# EasyEDA schematic SCH_Solenoid Door Lock using EM-18_2023-11-30.json

## Sheets
1 3x3 KeyPad: TITLE: Sheet_1; REV: 1.0; Date: 2023-11-17; Sheet: 1/1; Company: Your Company
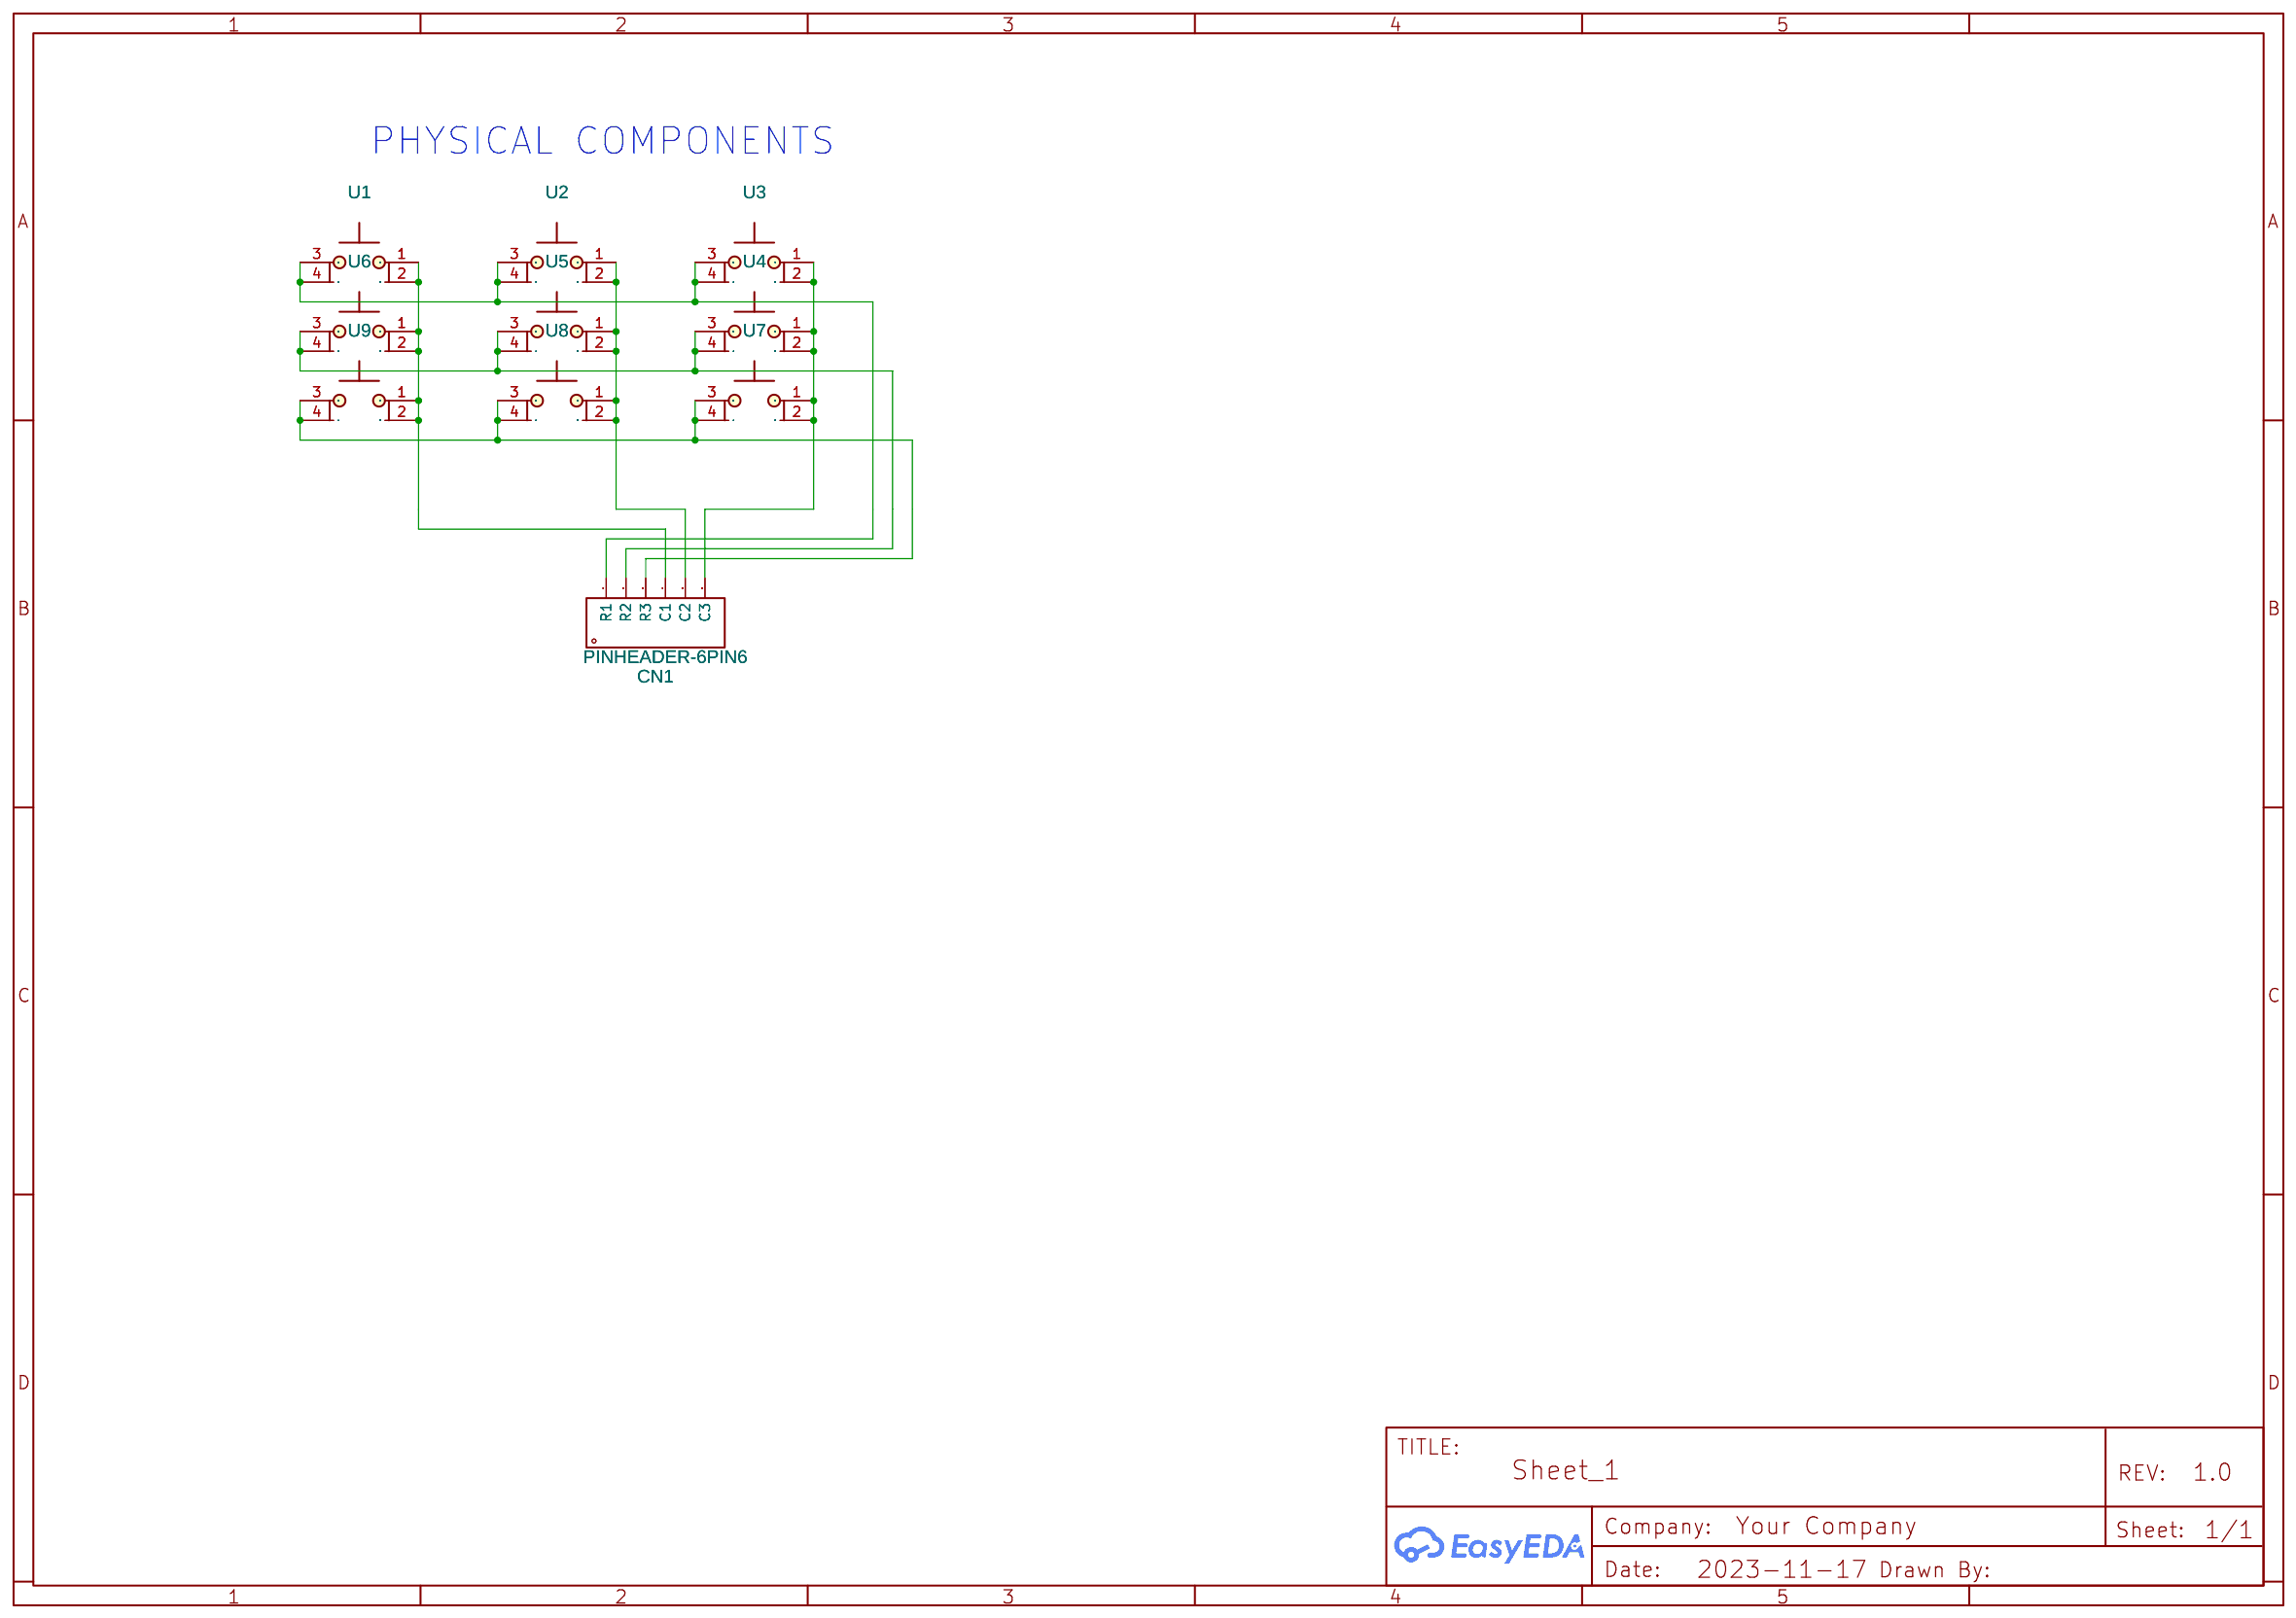
[diagram p0: 3x3 KeyPad]
2 EM-18 Module
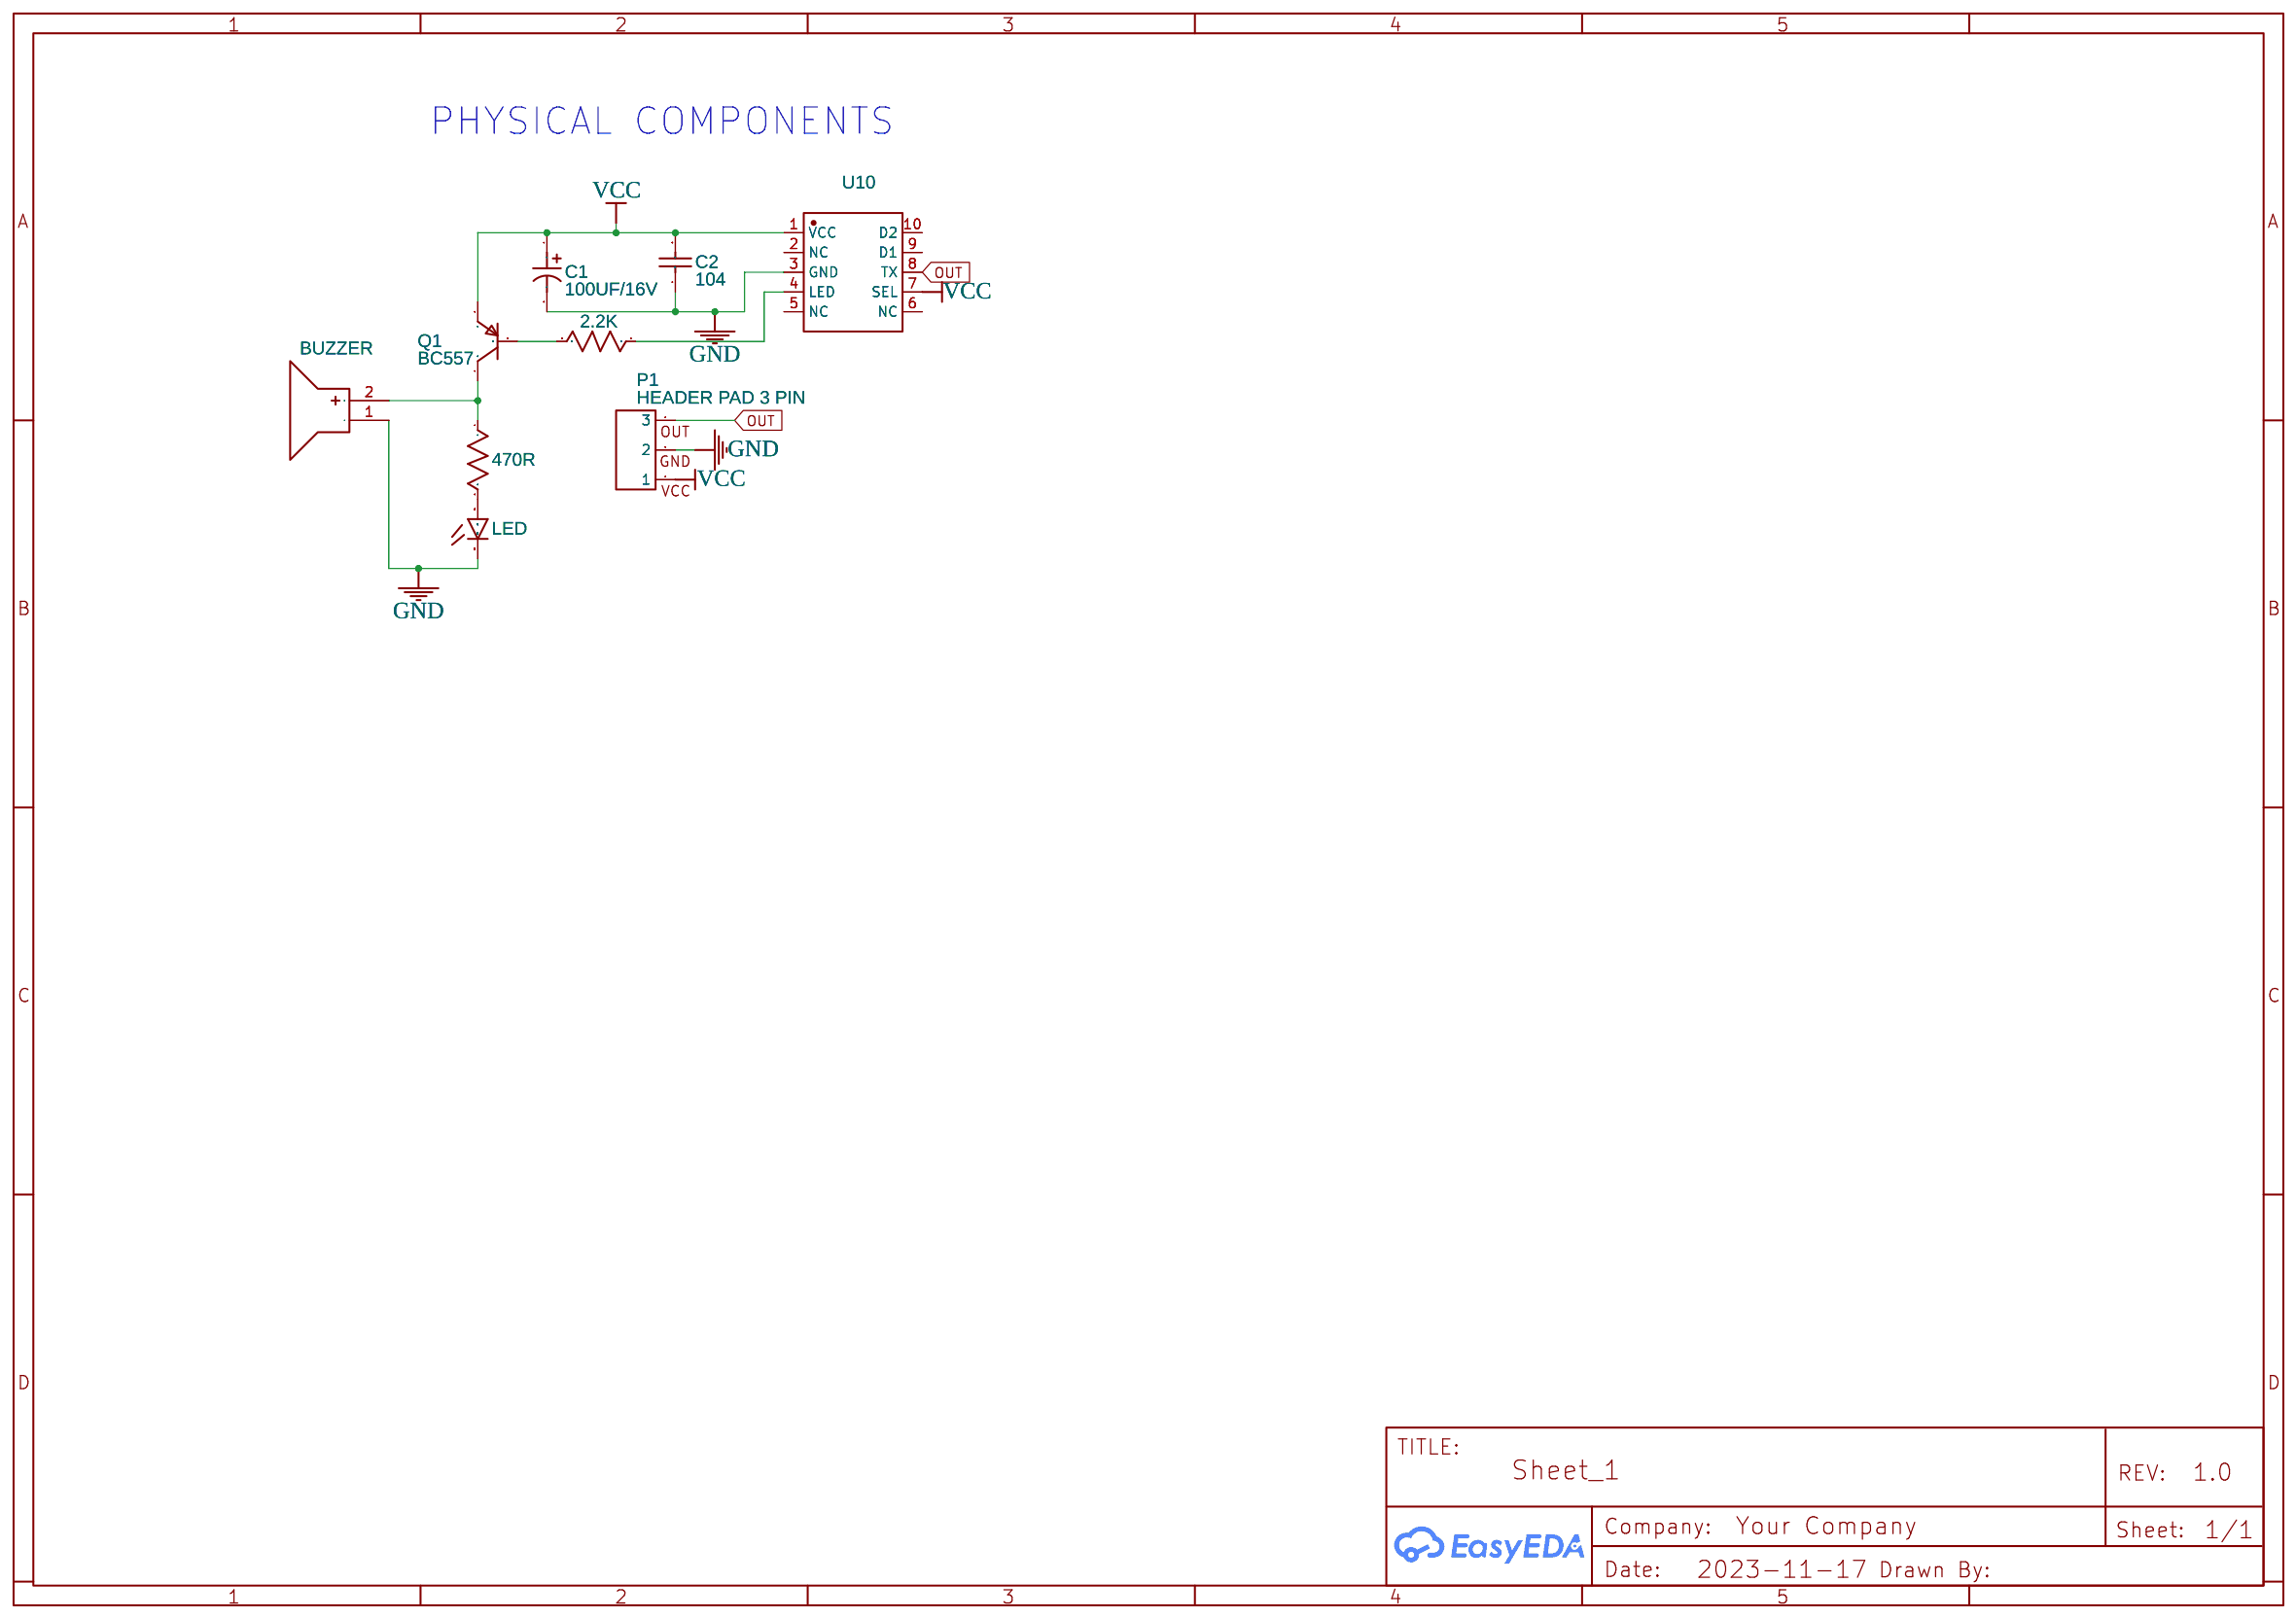
[diagram p1: EM-18 Module]
3 Relay Module
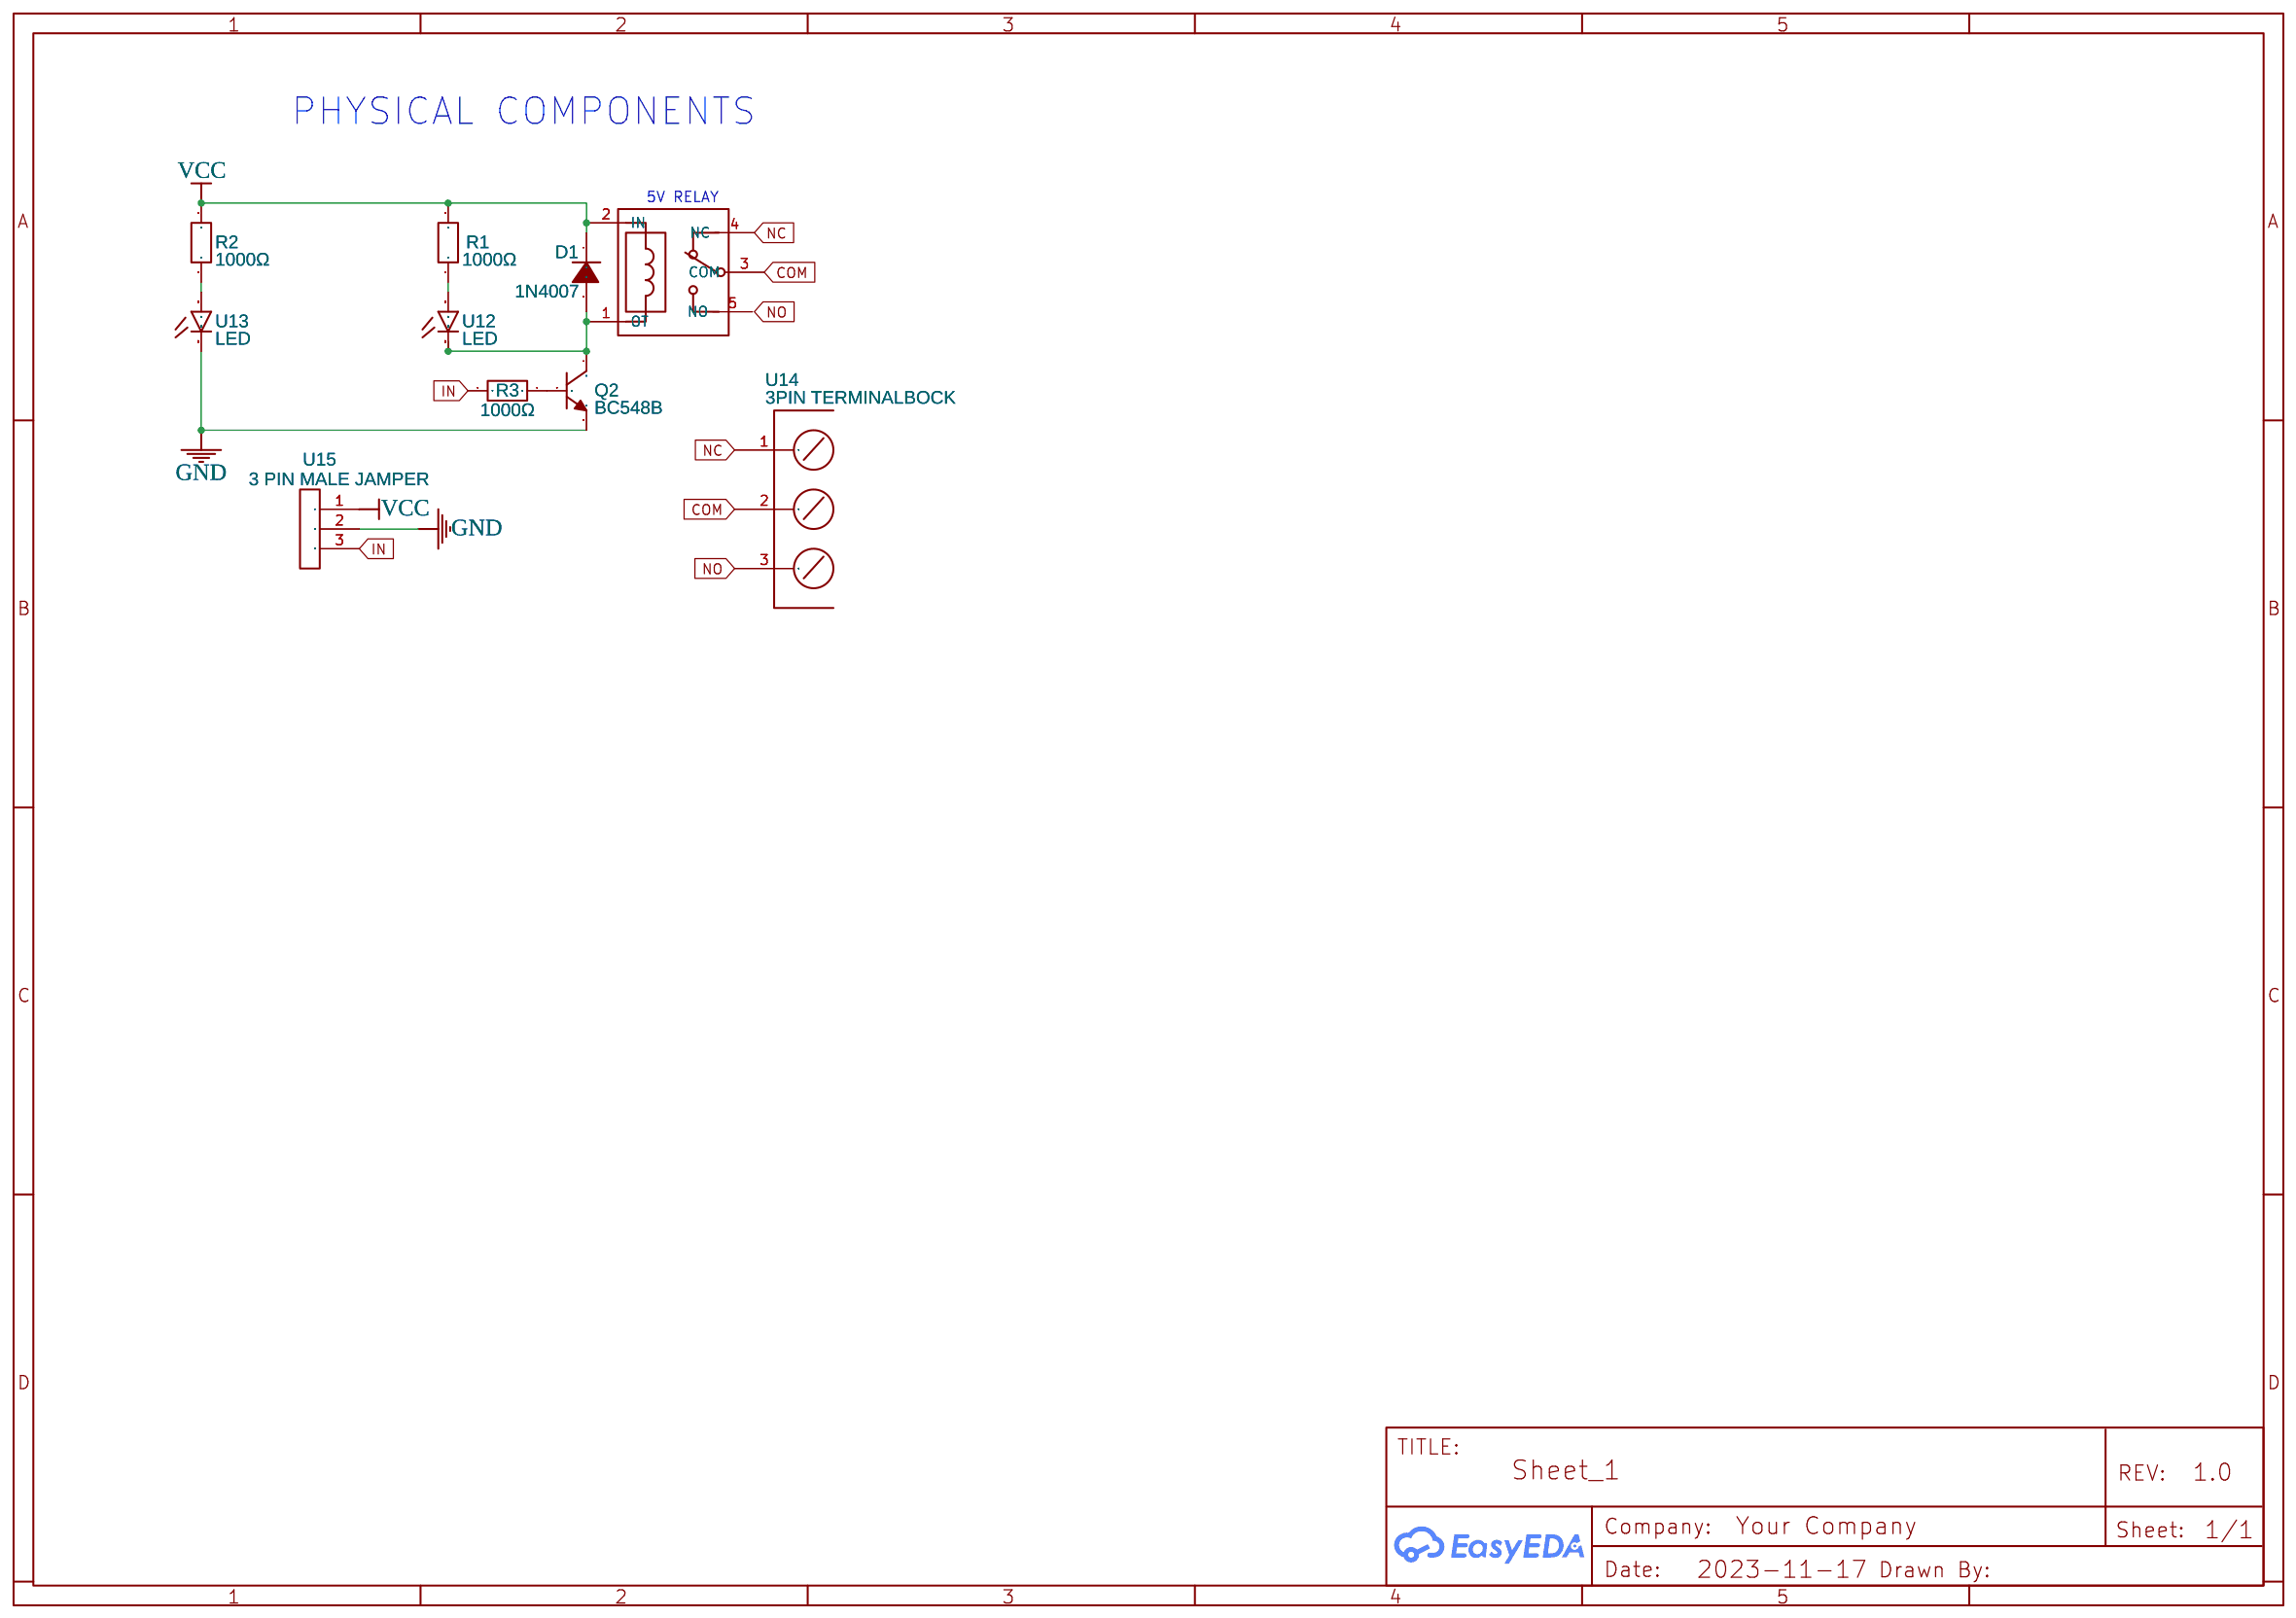
[diagram p2: Relay Module]
4 LCD Display: Date: 2023-11-18
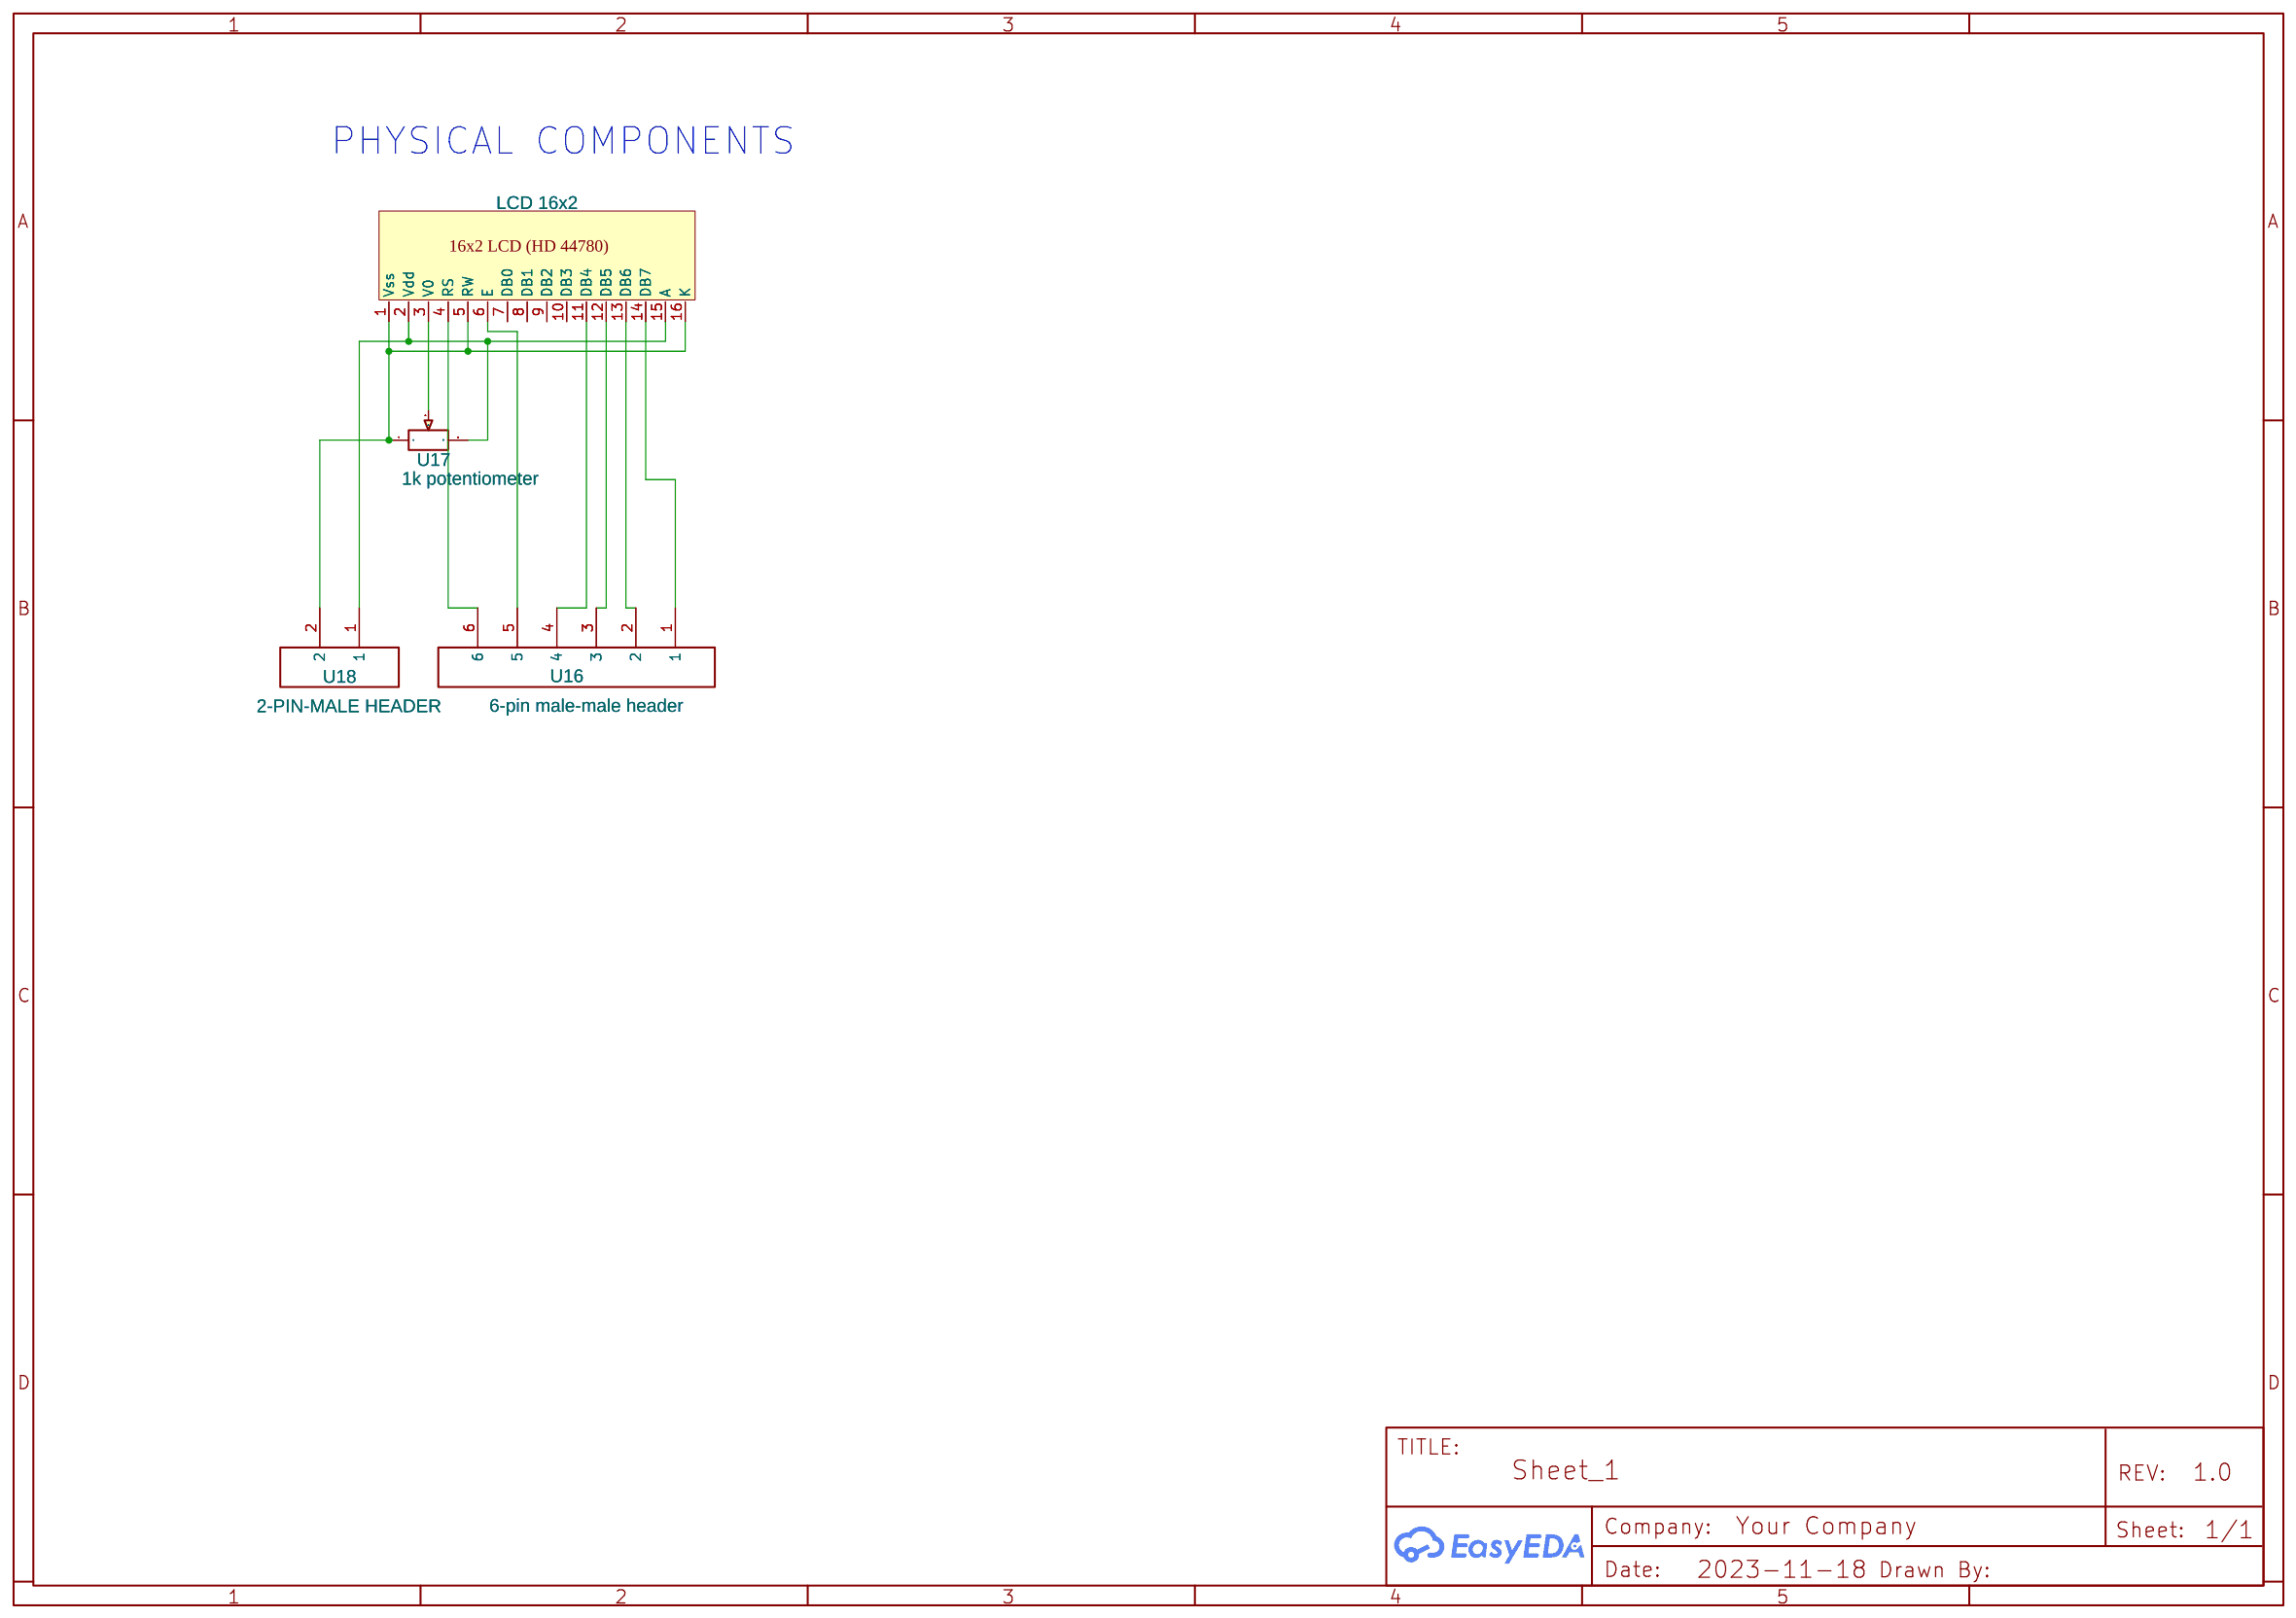
[diagram p3: LCD Display]
5 Final Display: Date: 2023-11-18
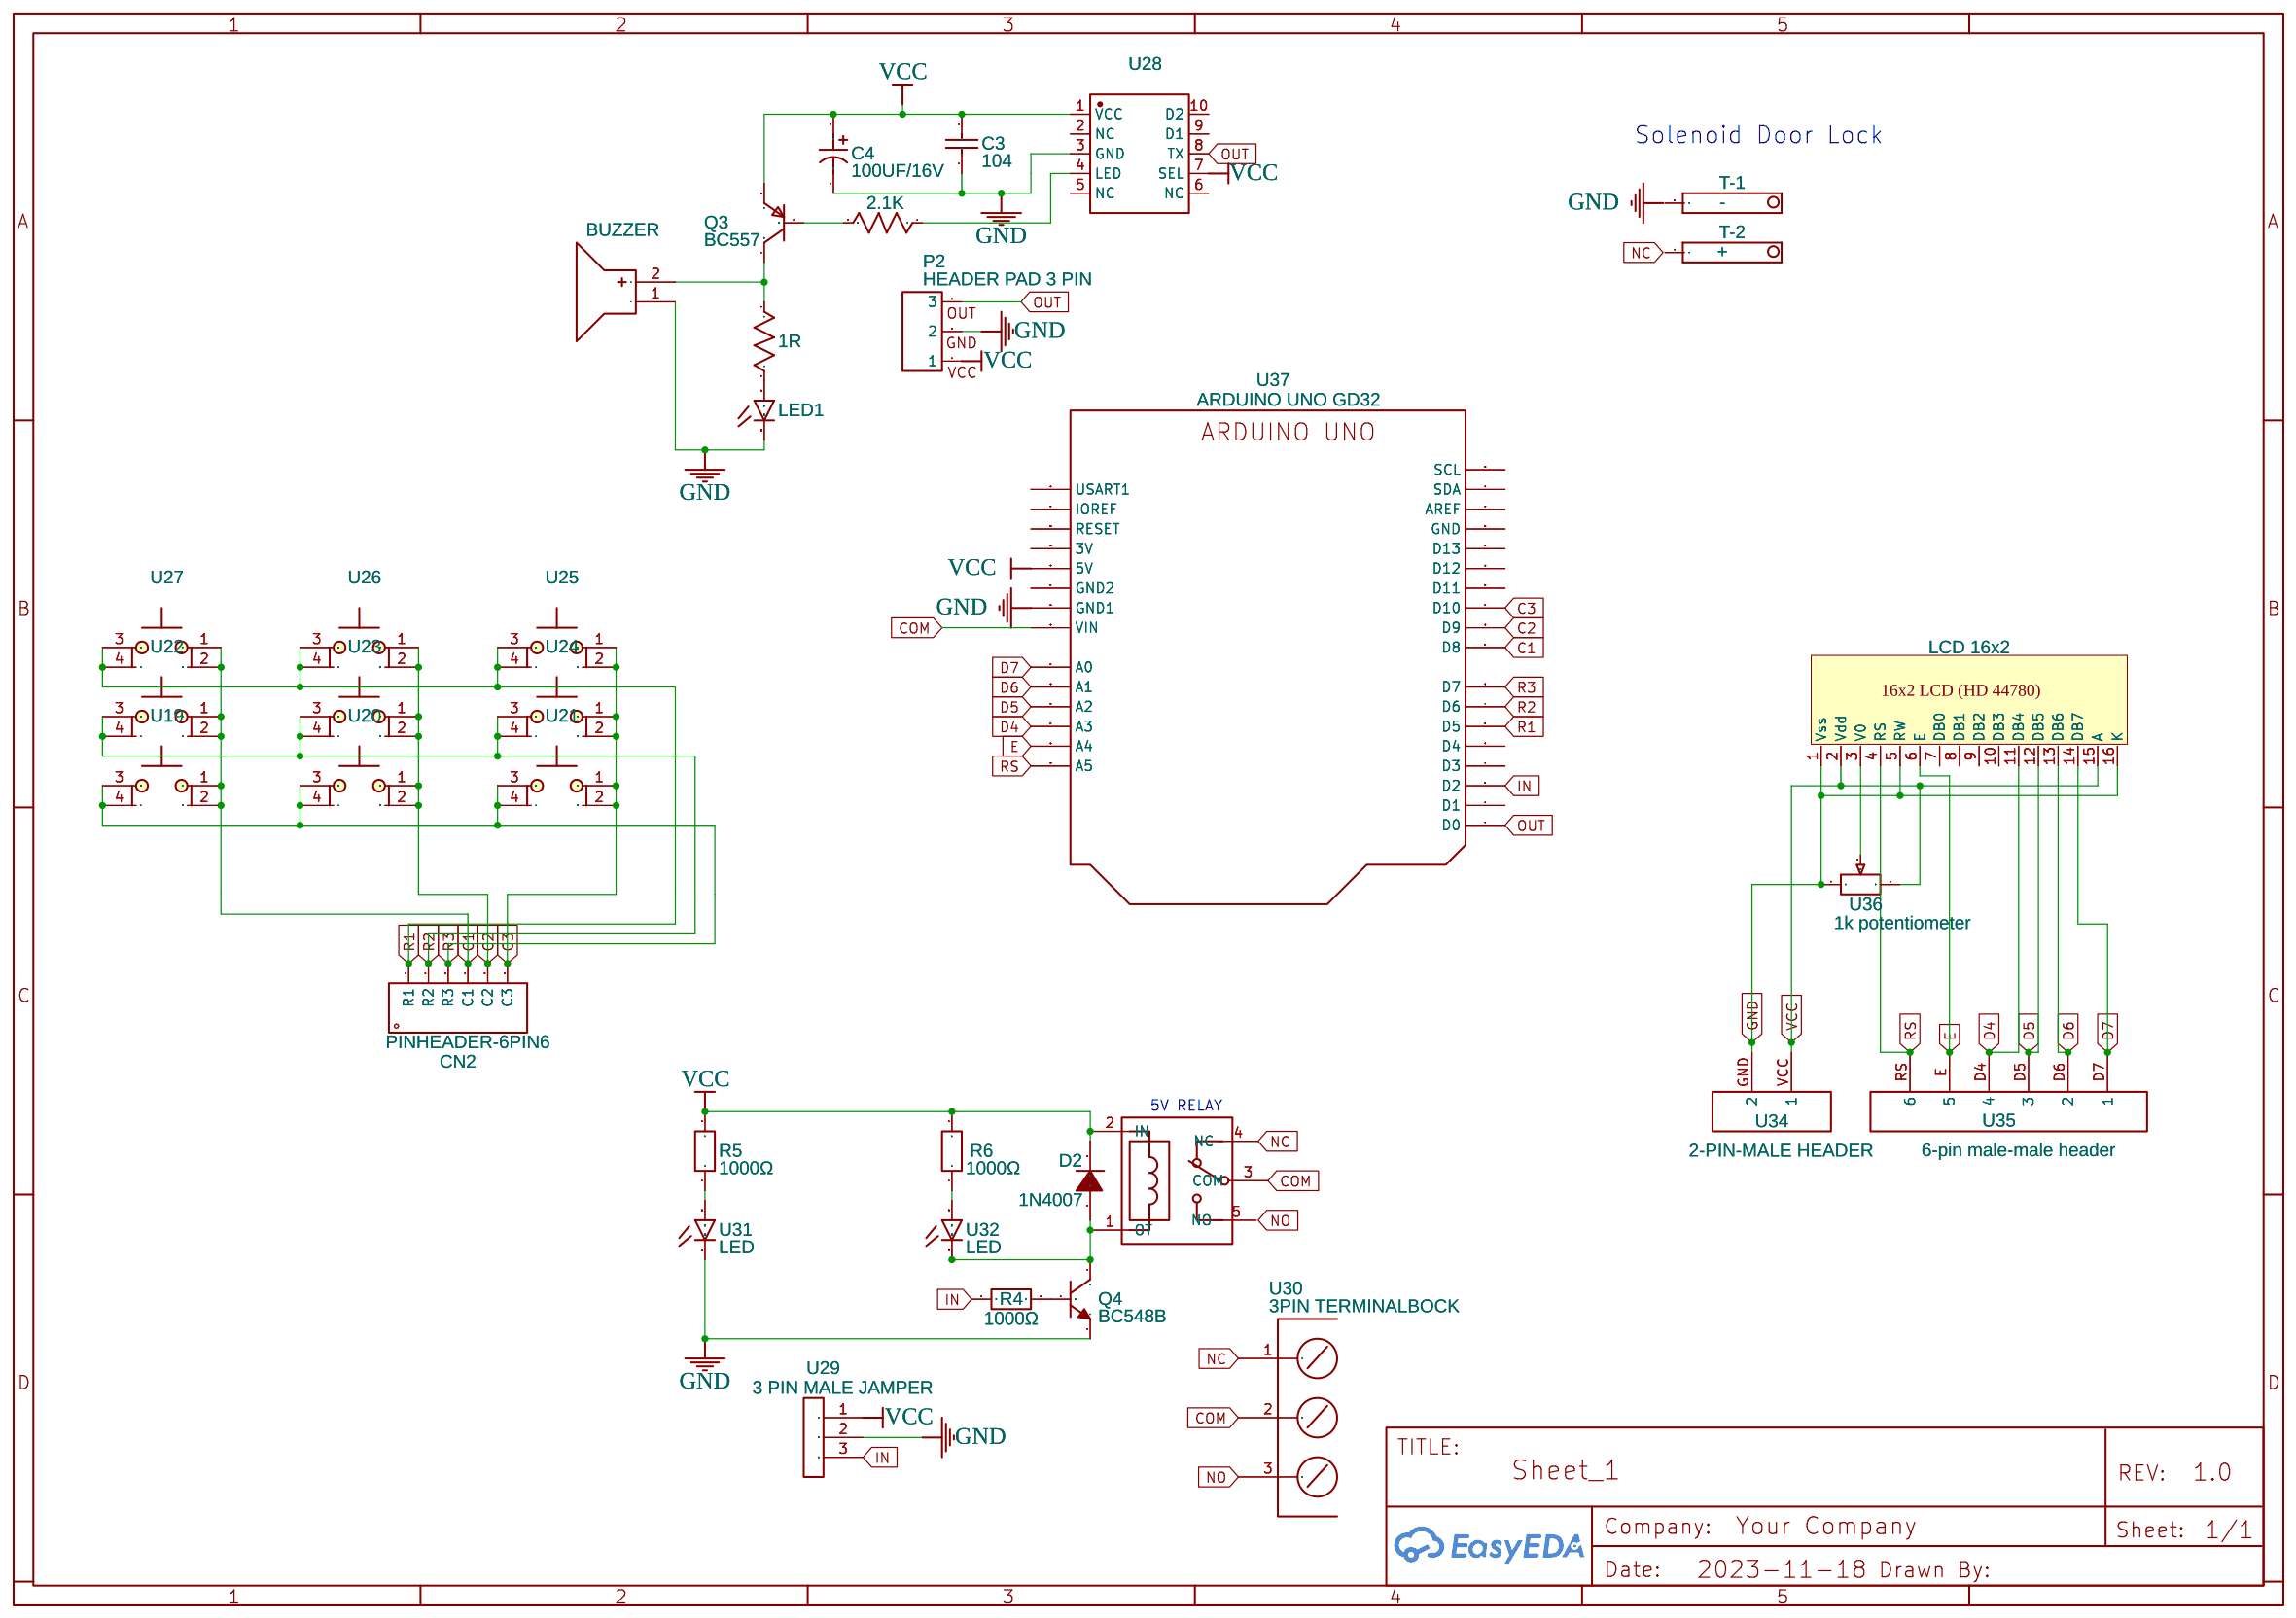
[diagram p4: Final Display]
6 Arduino_Keypad: Date: 2023-11-30
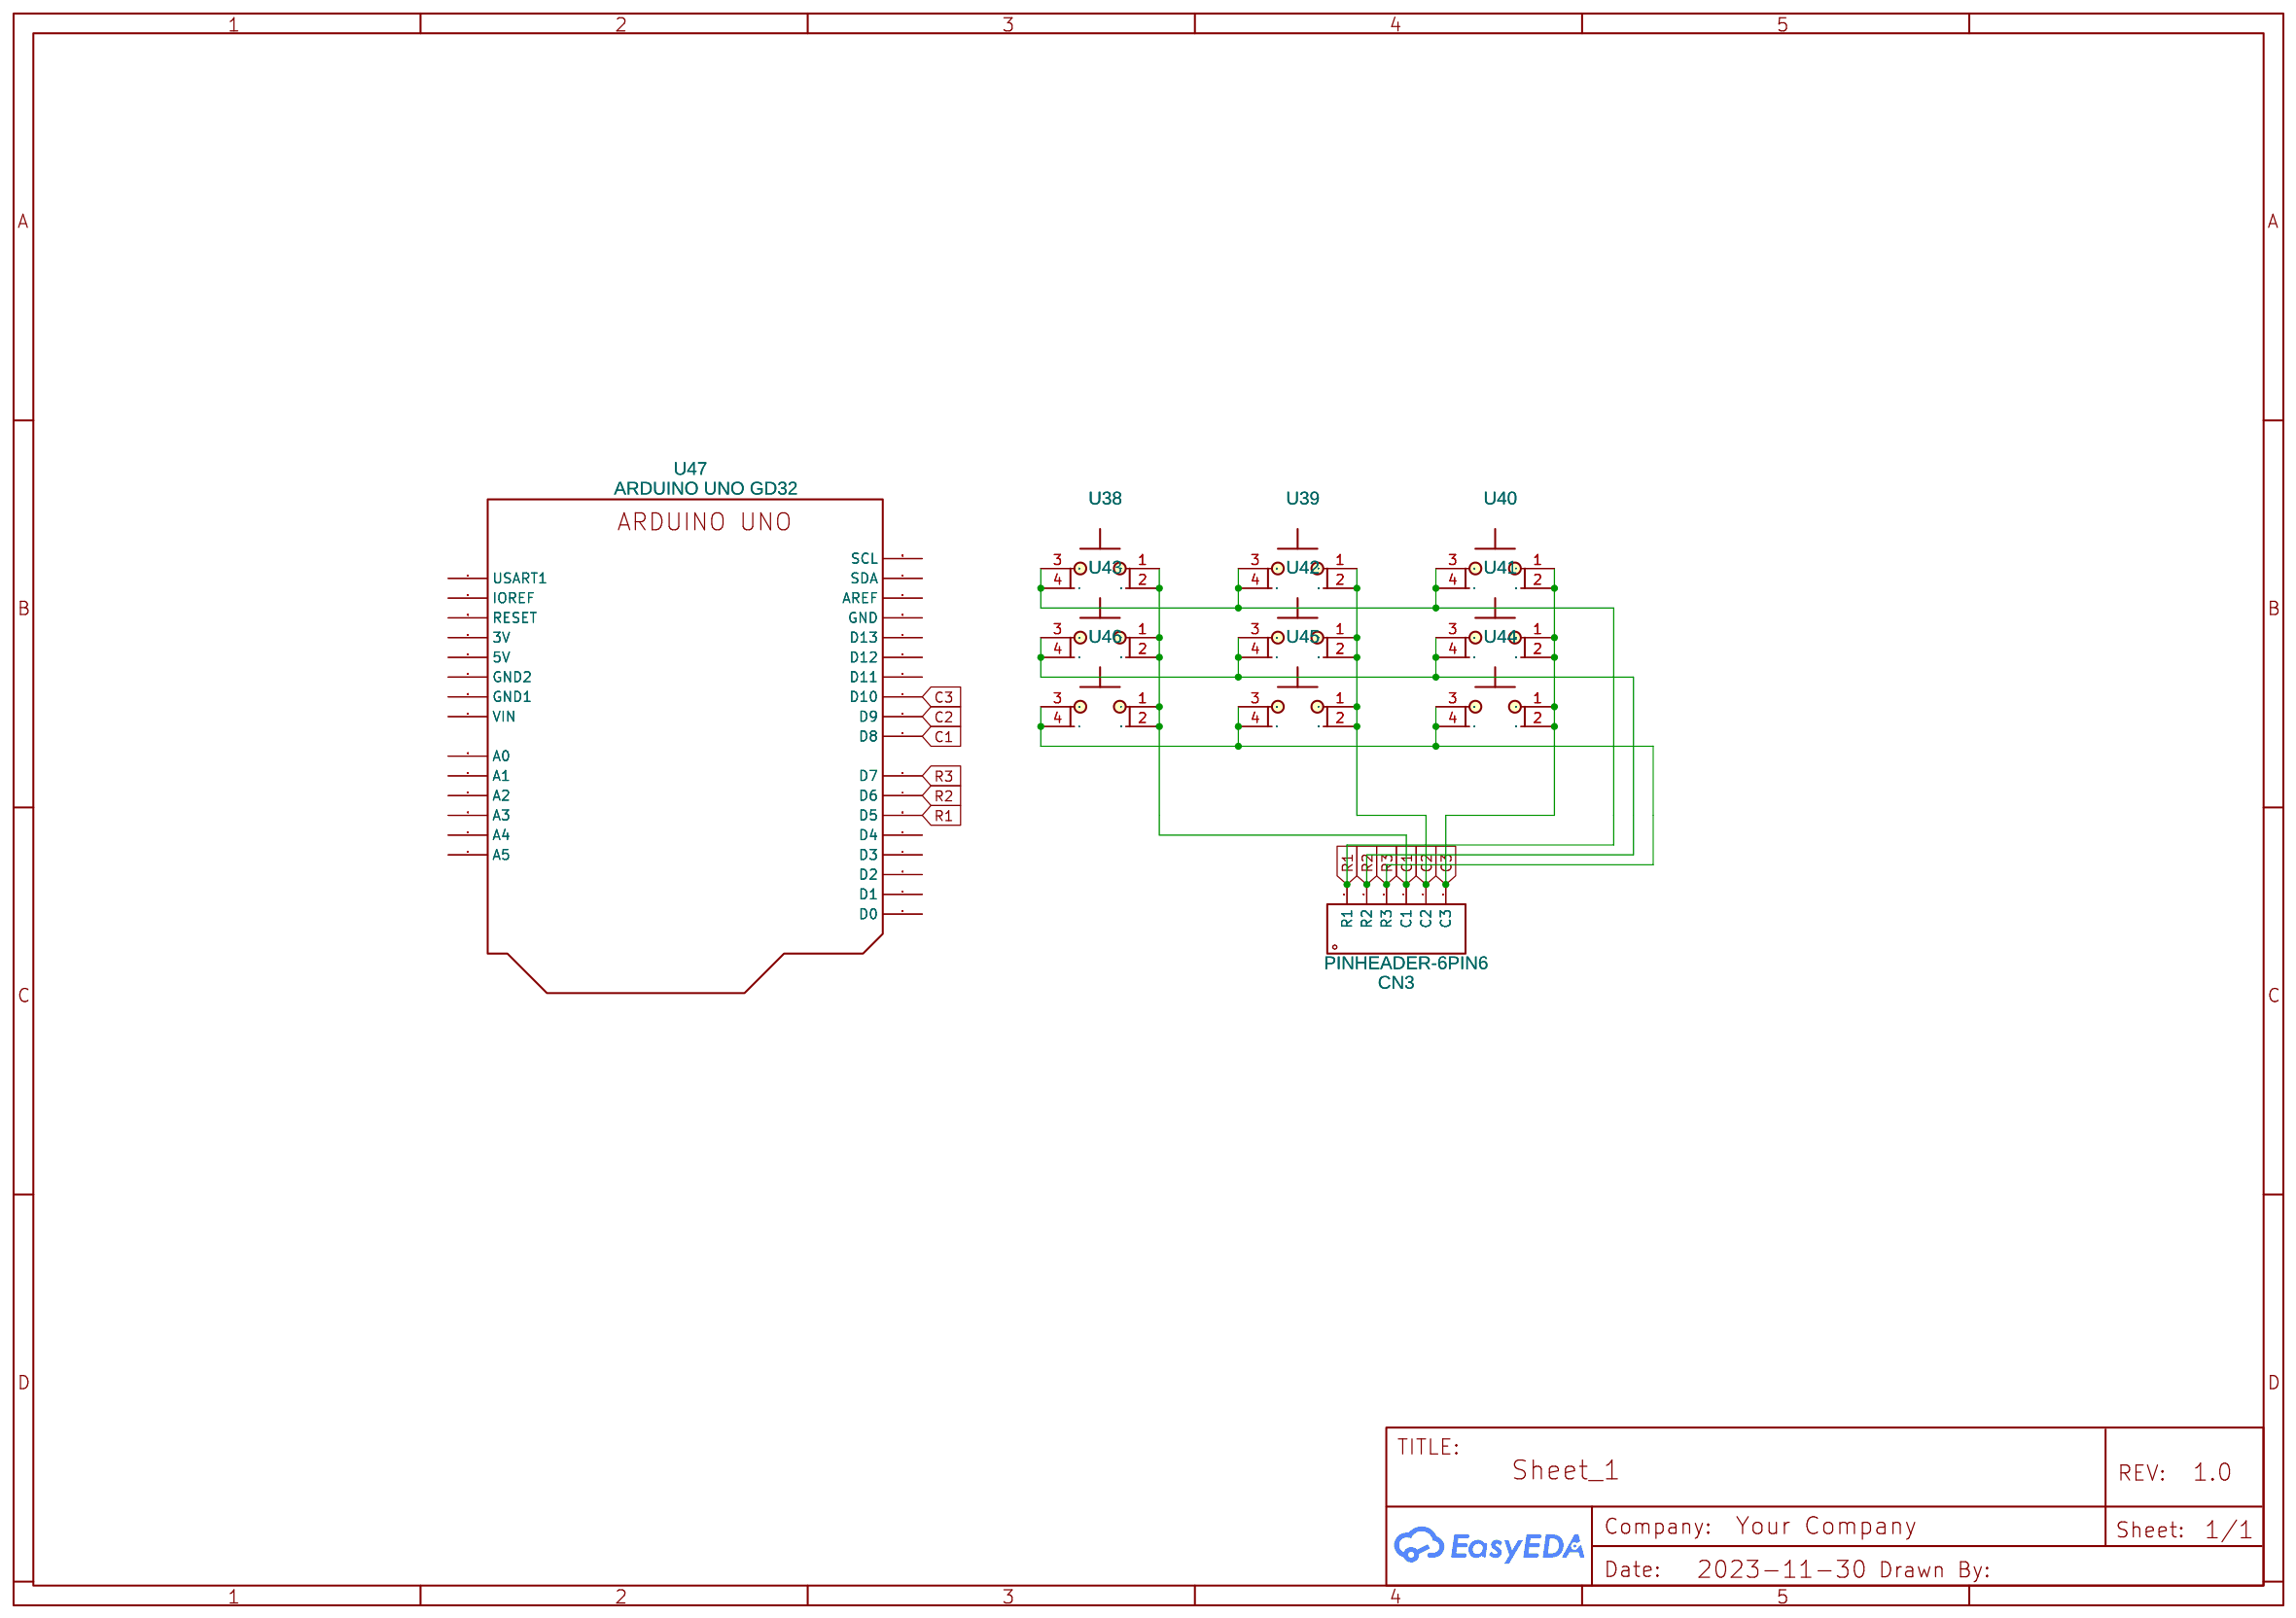
[diagram p5: Arduino_Keypad]
7 Arduino_LCD: Date: 2023-11-30
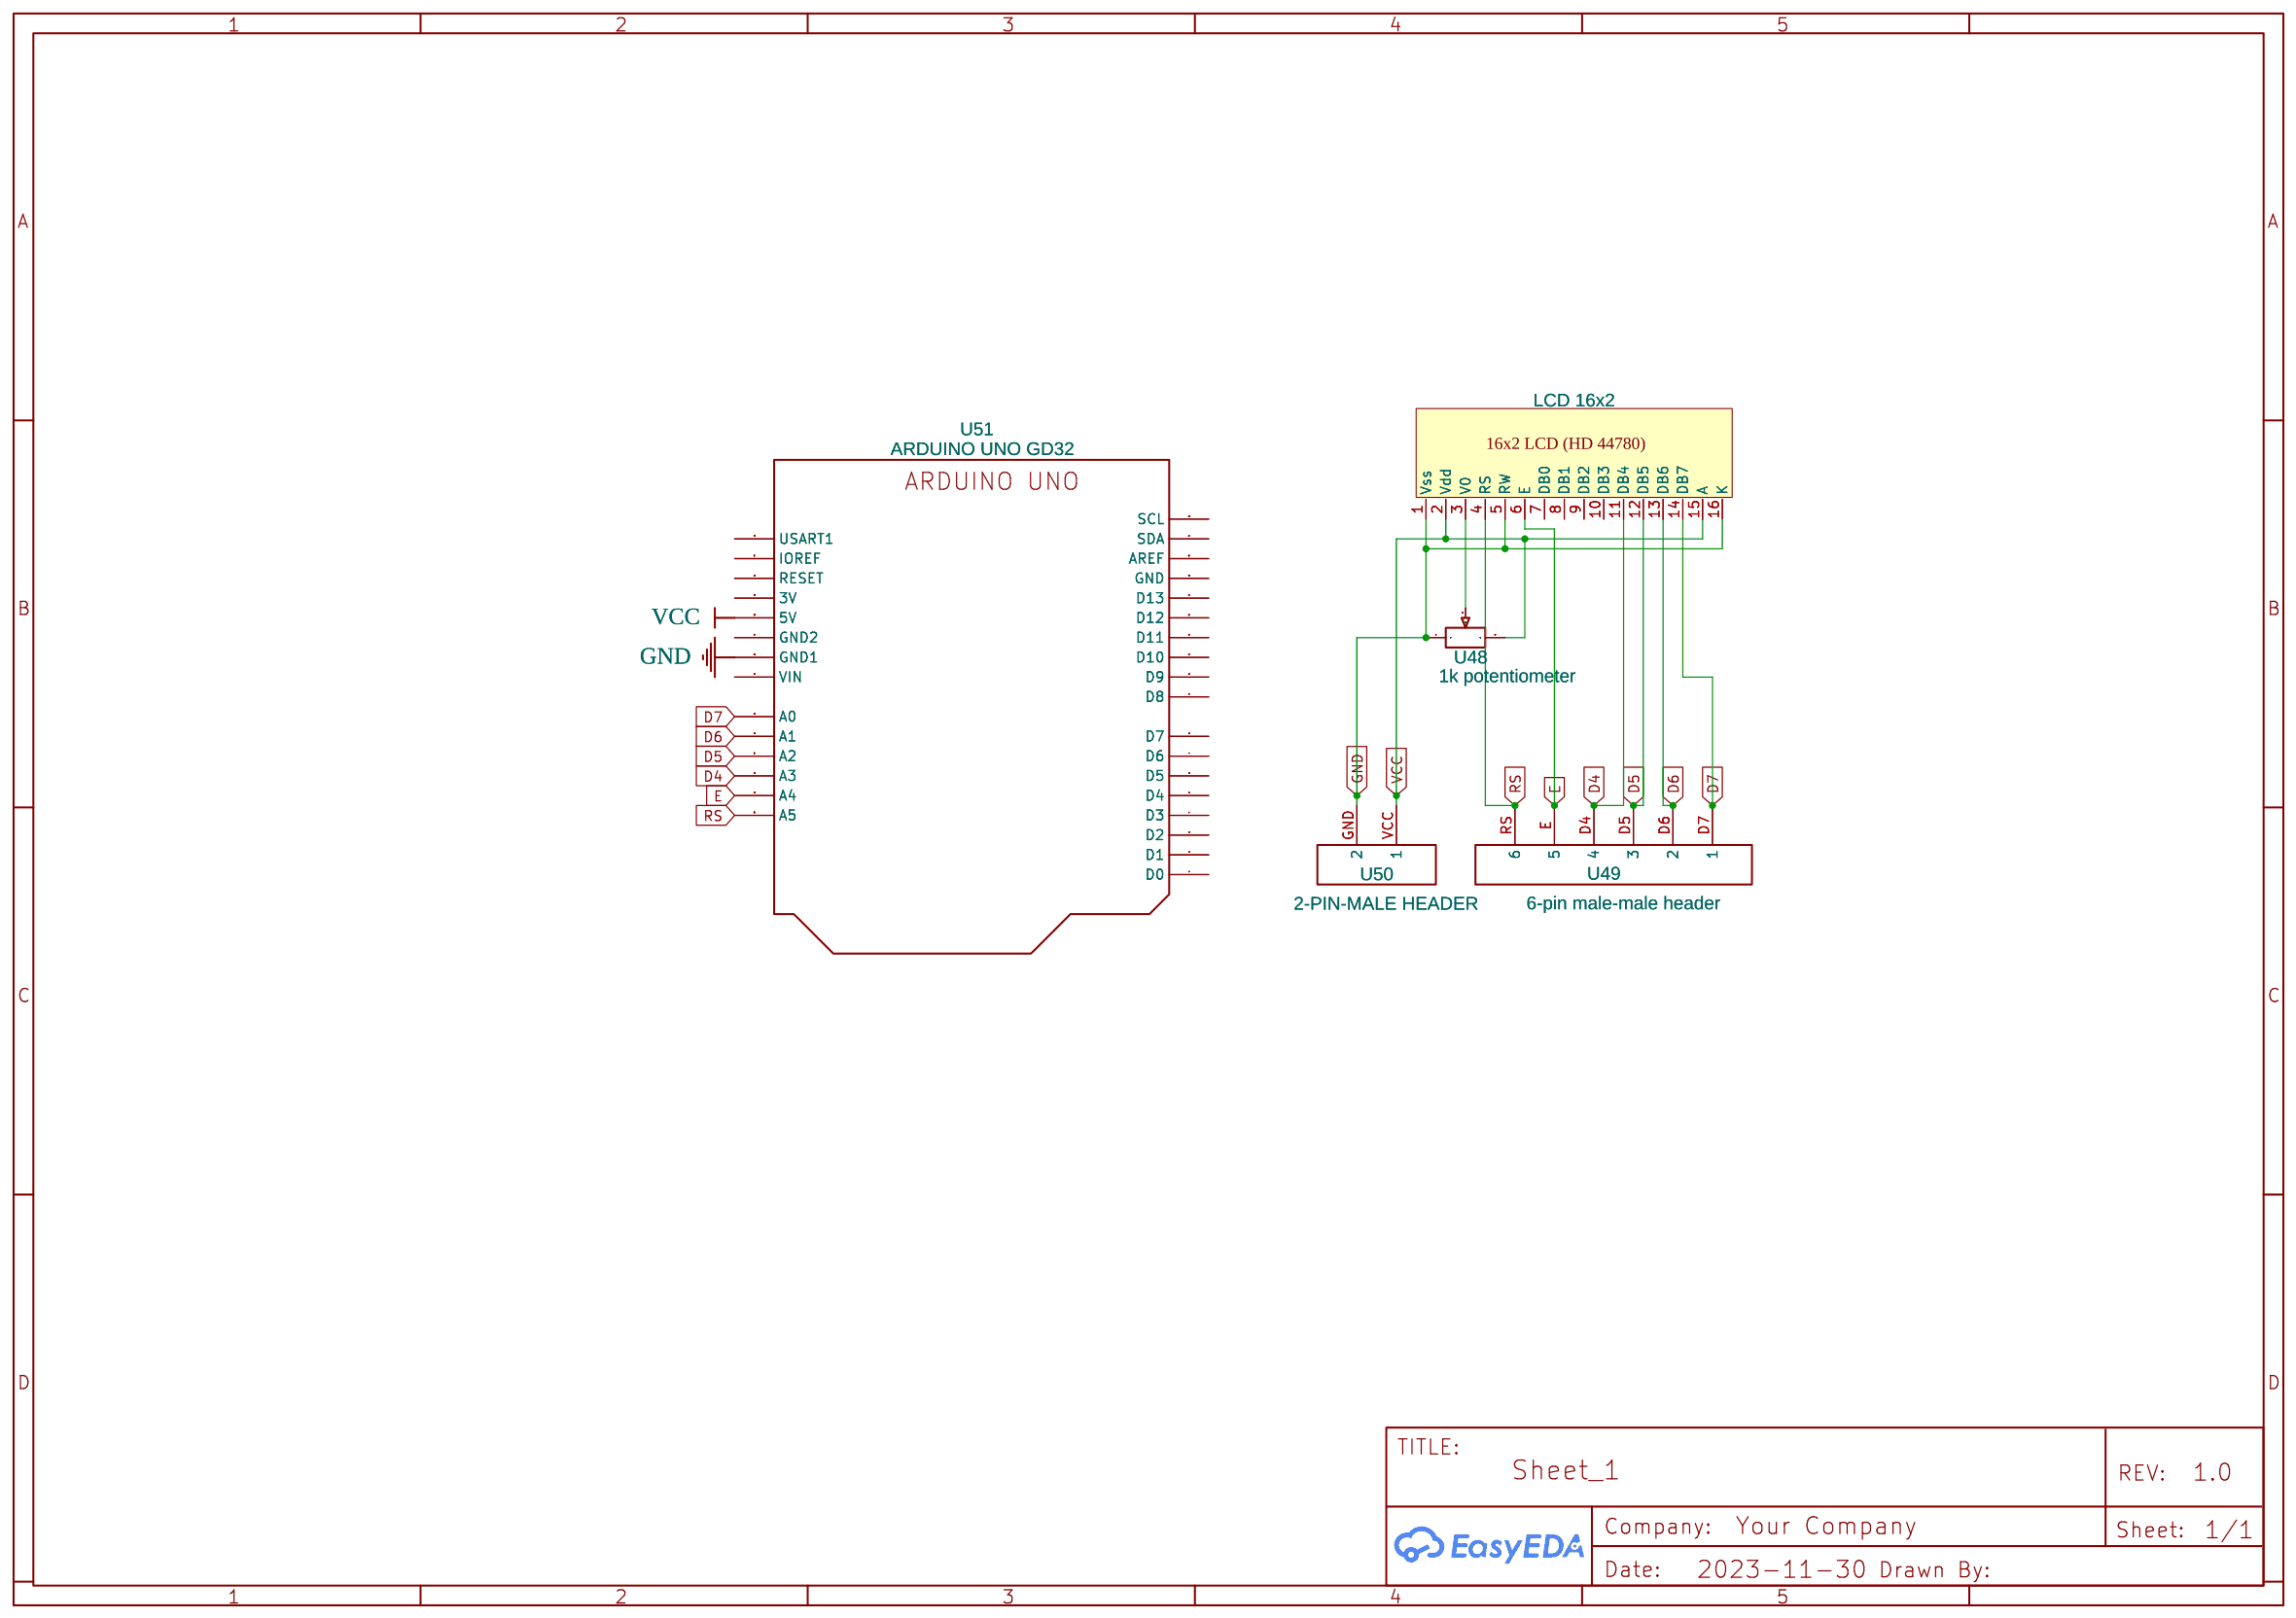
[diagram p6: Arduino_LCD]
8 Arduino_EM-18 Module: Date: 2023-11-30
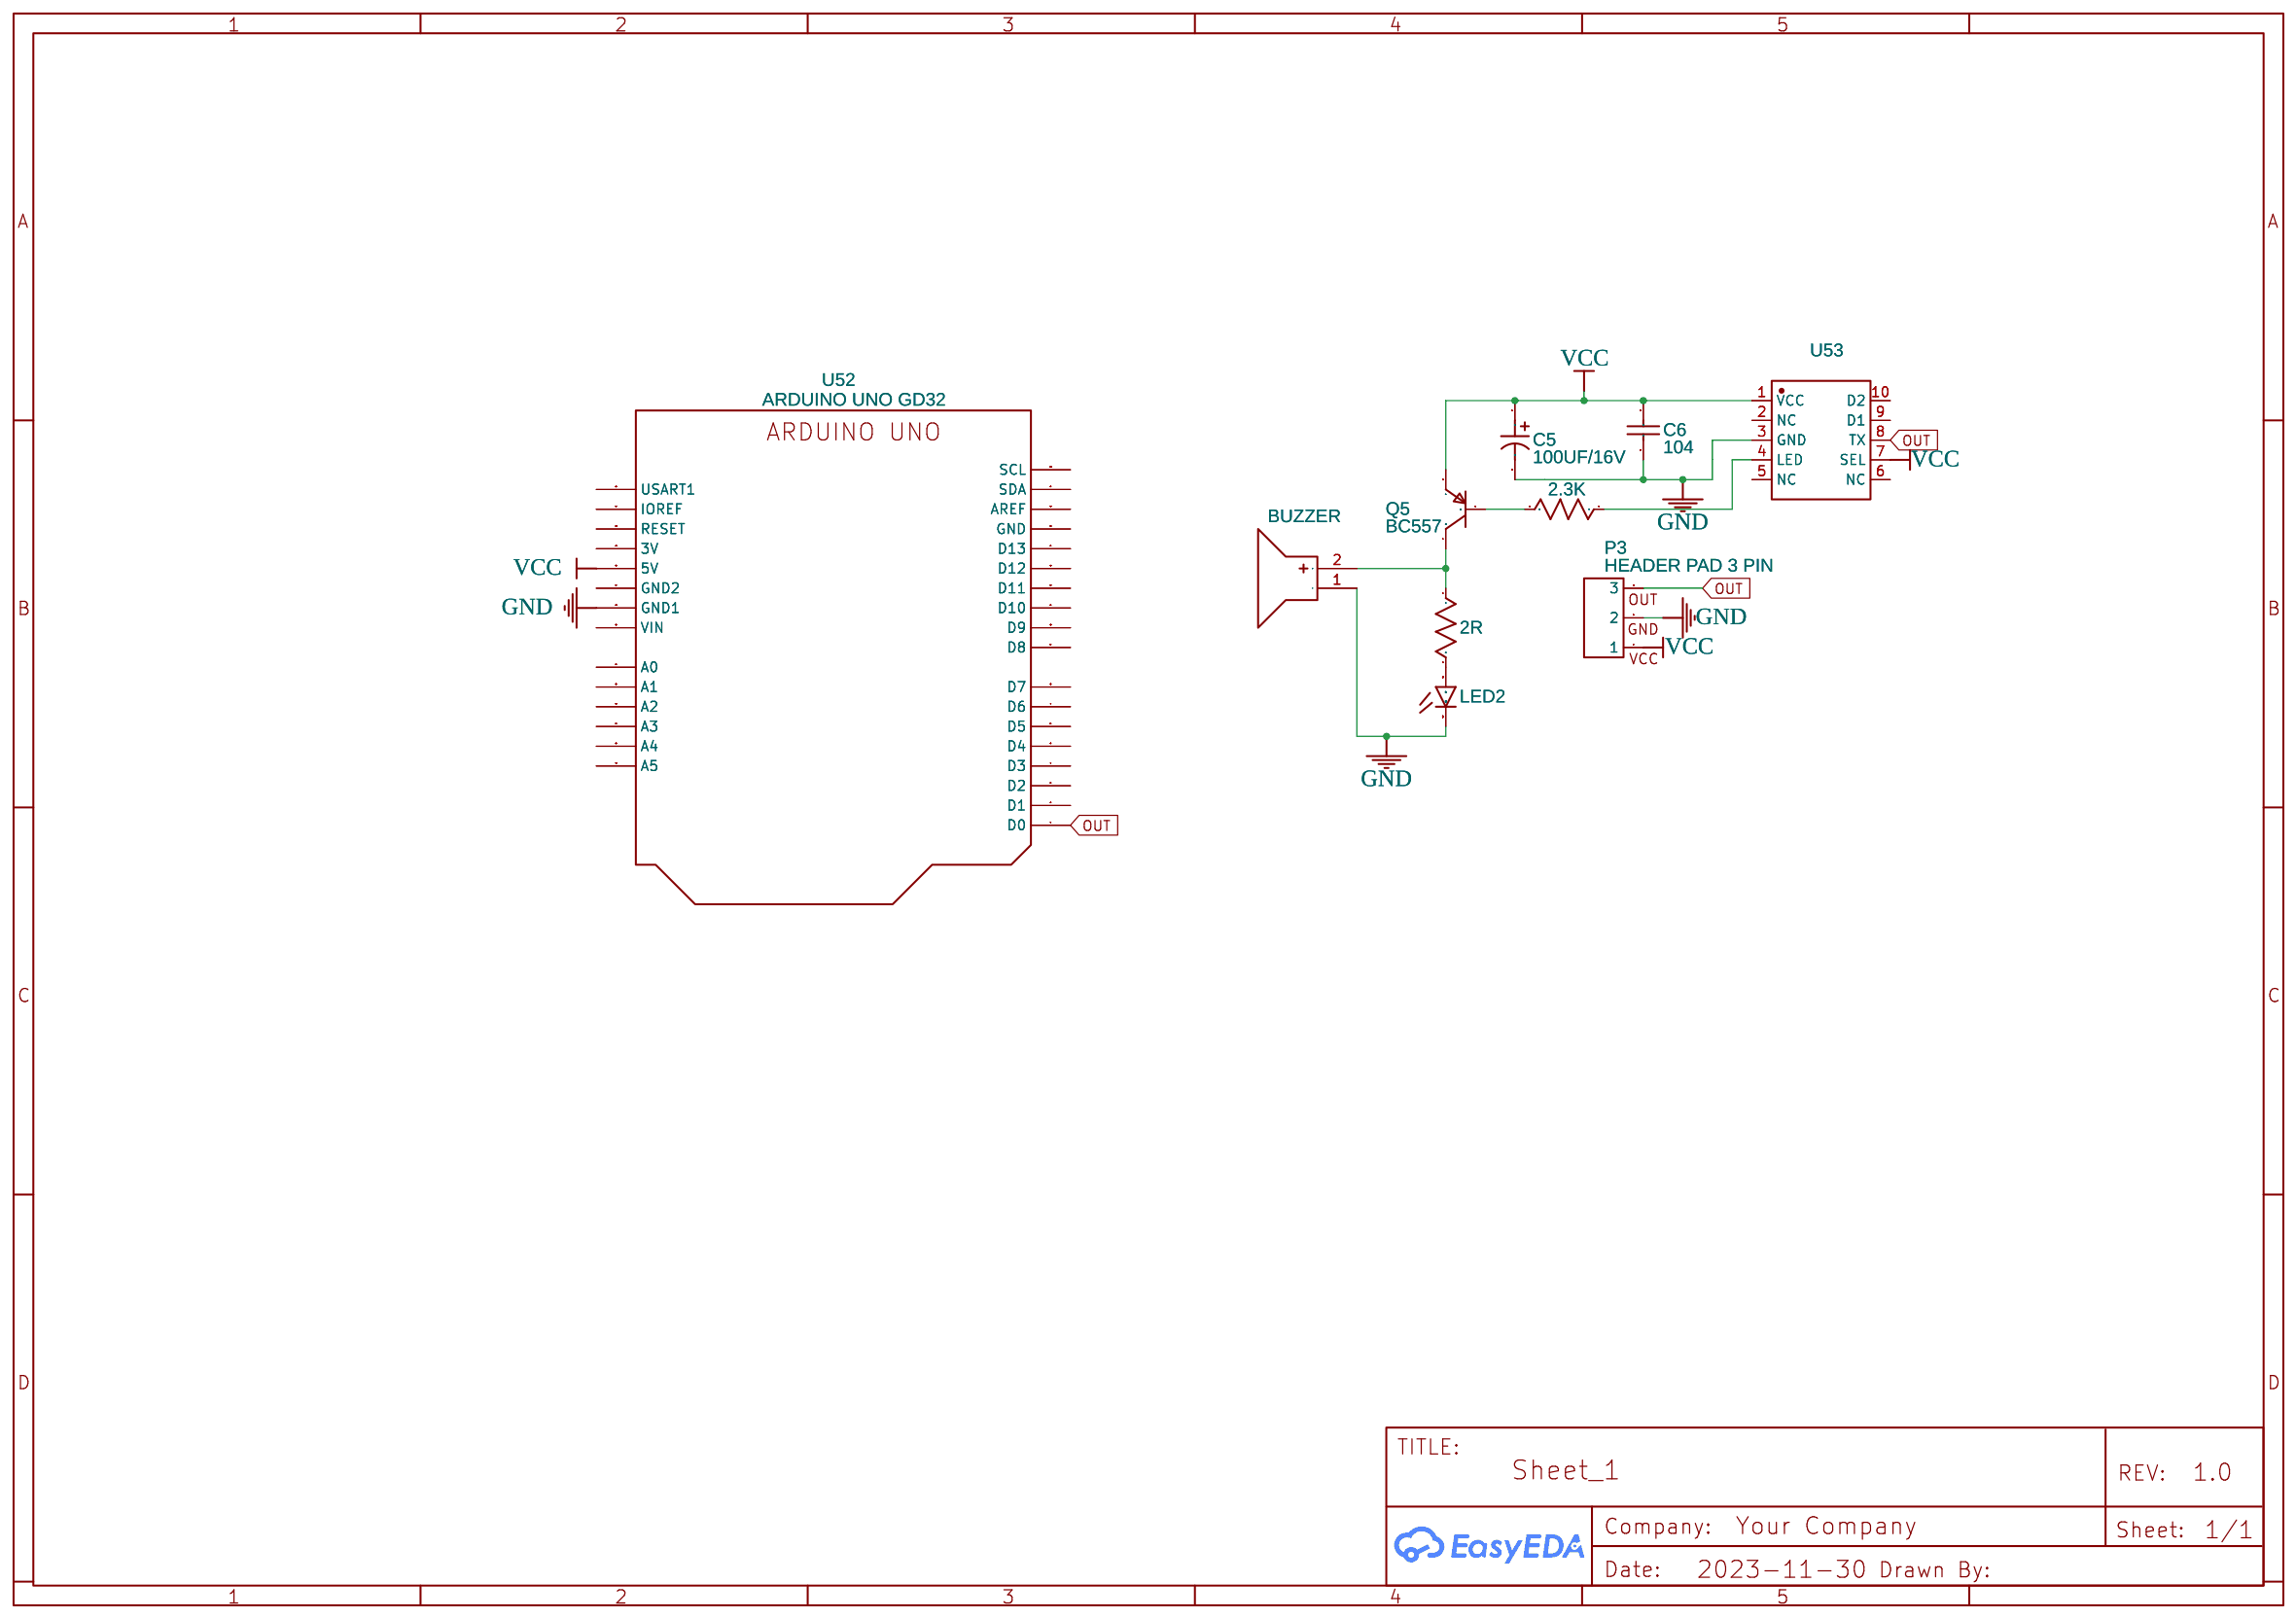
[diagram p7: Arduino_EM-18 Module]
9 Arduino_Relay Module: Date: 2023-11-30
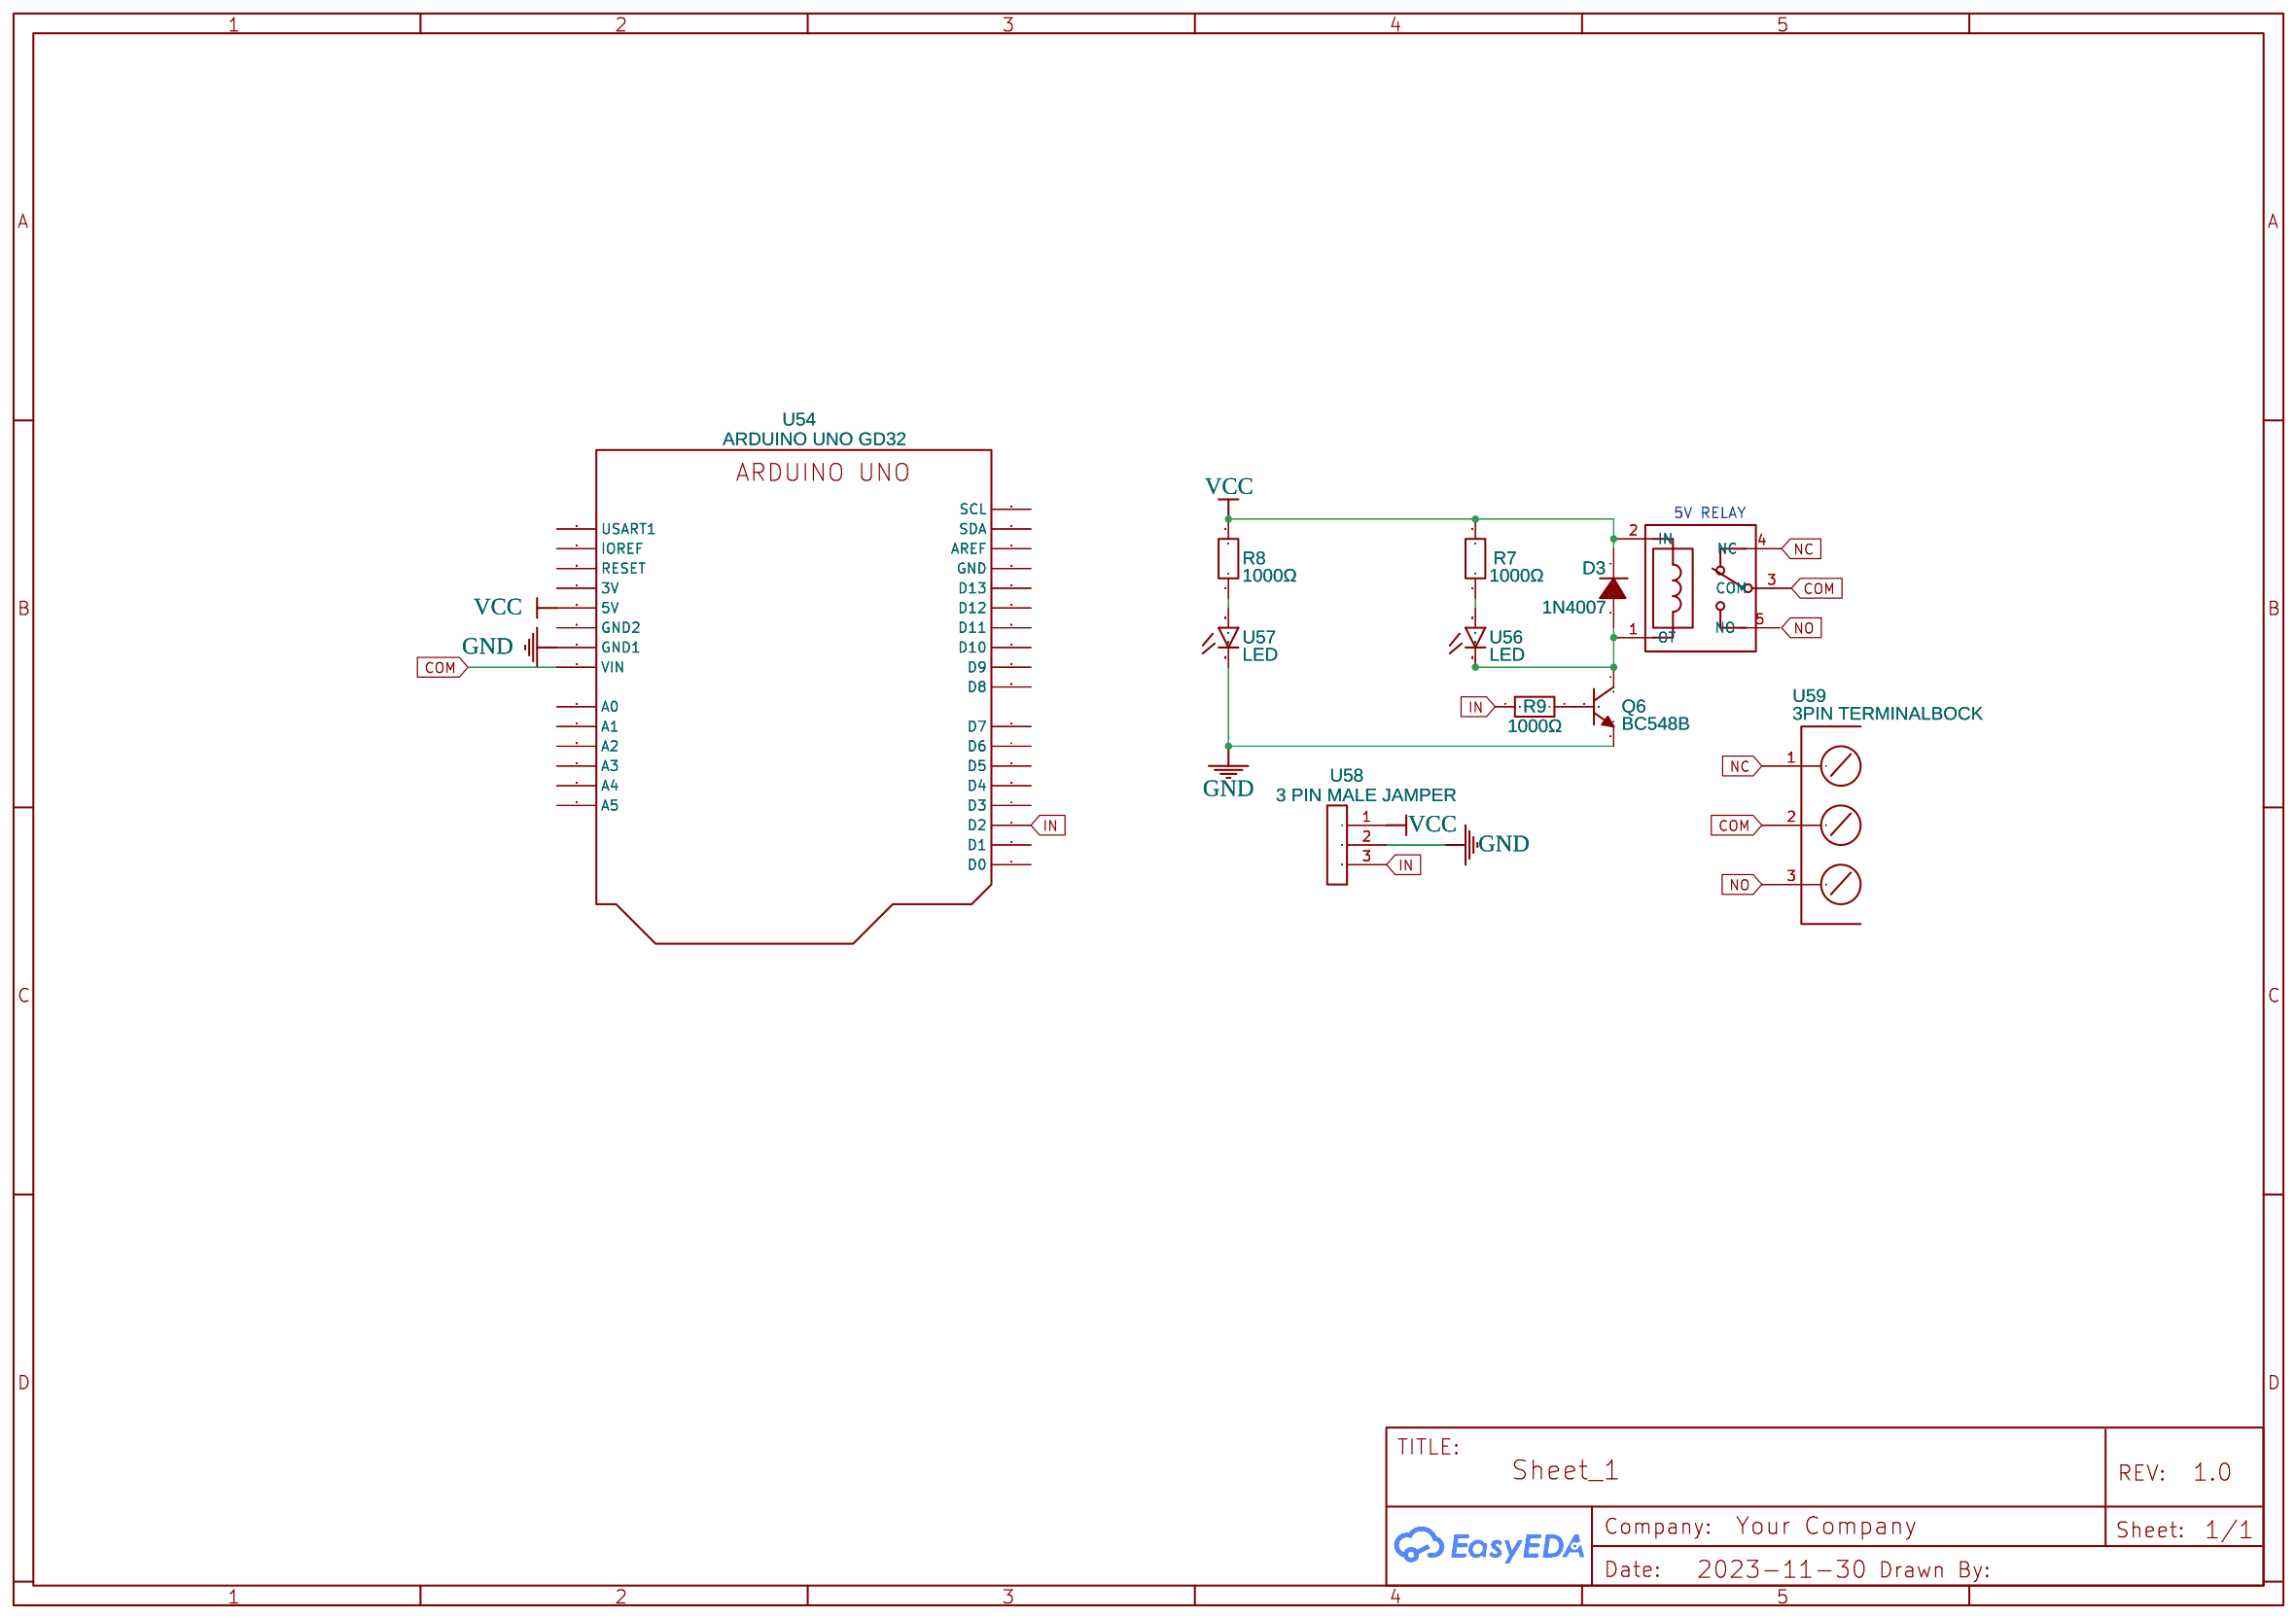
[diagram p8: Arduino_Relay Module]

## Parts
sheet 3x3 KeyPad
CN1  PINHEADER-6PIN6  [PINHEADER-6PIN]
U1  NO  [MICROSWITCH]
U2  NO  [MICROSWITCH]
U3  NO  [MICROSWITCH]
U4  NO  [MICROSWITCH]
U5  NO  [MICROSWITCH]
U6  NO  [MICROSWITCH]
U7  NO  [MICROSWITCH]
U8  NO  [MICROSWITCH]
U9  NO  [MICROSWITCH]
sheet Arduino_EM-18 Module
2.3K  NO  [2.2K METAL FILM 1/4W RESISTOR]
2R  NO  [2.2K METAL FILM 1/4W RESISTOR]
BUZZER3  BUZZER  [BUZ-TH_BD12.0-P6.00-D0.9-RD]
C5  100UF/16V  [CAP-TH_BD6.3-P2.50-D0.5-FD]
C6  104  [NP CAP-8*3.5-5.08MM]
LED2  NO  [LED5]
P3  HEADER PAD 3 PIN  [CONNECTOR_PINHEADER_2.54MM:PINHEADER_1X3]
Q5  BC557  [TO-92-3_L4.9-W3.7-P1.27-R]
U52  ARDUINO UNO GD32  [UNO_R3;WO ARDUINO UNO]
U53  NO  [EM_18]
sheet Arduino_Keypad
CN3  PINHEADER-6PIN6  [PINHEADER-6PIN]
U38  NO  [MICROSWITCH]
U39  NO  [MICROSWITCH]
U40  NO  [MICROSWITCH]
U41  NO  [MICROSWITCH]
U42  NO  [MICROSWITCH]
U43  NO  [MICROSWITCH]
U44  NO  [MICROSWITCH]
U45  NO  [MICROSWITCH]
U46  NO  [MICROSWITCH]
U47  ARDUINO UNO GD32  [UNO_R3;WO ARDUINO UNO]
sheet Arduino_LCD
LCD3  LCD 16x2  [CLASE10LCD16X2]
U48  1k potentiometer  [POTENTIOMETER BLUE]
U49  6-pin male-male header  [5-PIN MALE-MALE HEADER]
U50  2-PIN-MALE HEADER  [2PIN-MALE HEADER]
U51  ARDUINO UNO GD32  [UNO_R3;WO ARDUINO UNO]
sheet Arduino_Relay Module
D3  1N4007  [DO-41_BD2.4-L4.7-P8.70-D0.9-RD]
Q6  BC548B  [TO-92-3_L4.9-W3.7-P1.27-L]
R7  1000Ω  [330Ω RESISTANCE]
R8  1000Ω  [330Ω RESISTANCE]
R9  1000Ω  [330Ω RESISTANCE]
U54  ARDUINO UNO GD32  [UNO_R3;WO ARDUINO UNO]
U55  NO  [RELAY-TH_SRD-XXVDC-XL-C]
U56  LED  [LED5]
U57  LED  [LED5]
U58  3 PIN MALE JAMPER  [3PIN FEMALE HEADER]
U59  3PIN TERMINALBOCK  [5A_3PIN-TERMINALBLOCK]
sheet EM-18 Module
2.2K  -  [2.2K METAL FILM 1/4W RESISTOR]
470R  -  [2.2K METAL FILM 1/4W RESISTOR]
BUZZER1  BUZZER  [BUZ-TH_BD12.0-P6.00-D0.9-RD]
C1  100UF/16V  [CAP-TH_BD6.3-P2.50-D0.5-FD]
C2  104  [NP CAP-8*3.5-5.08MM]
LED  -  [LED5]
P1  HEADER PAD 3 PIN  [CONNECTOR_PINHEADER_2.54MM:PINHEADER_1X3]
Q1  BC557  [TO-92-3_L4.9-W3.7-P1.27-R]
U10  -  [EM_18]
sheet Final Display
1R  NO  [2.2K METAL FILM 1/4W RESISTOR]
2.1K  NO  [2.2K METAL FILM 1/4W RESISTOR]
+  T-2  [TERMINAL-BLOCK-2-PIN-3.5MM-LONG-PAD]
-  T-1  [TERMINAL-BLOCK-2-PIN-3.5MM-LONG-PAD]
BUZZER2  BUZZER  [BUZ-TH_BD12.0-P6.00-D0.9-RD]
C3  104  [NP CAP-8*3.5-5.08MM]
C4  100UF/16V  [CAP-TH_BD6.3-P2.50-D0.5-FD]
CN2  PINHEADER-6PIN6  [PINHEADER-6PIN]
D2  1N4007  [DO-41_BD2.4-L4.7-P8.70-D0.9-RD]
LCD2  LCD 16x2  [CLASE10LCD16X2]
LED1  NO  [LED5]
P2  HEADER PAD 3 PIN  [CONNECTOR_PINHEADER_2.54MM:PINHEADER_1X3]
Q3  BC557  [TO-92-3_L4.9-W3.7-P1.27-R]
Q4  BC548B  [TO-92-3_L4.9-W3.7-P1.27-L]
R4  1000Ω  [330Ω RESISTANCE]
R5  1000Ω  [330Ω RESISTANCE]
R6  1000Ω  [330Ω RESISTANCE]
U19  NO  [MICROSWITCH]
U20  NO  [MICROSWITCH]
U21  NO  [MICROSWITCH]
U22  NO  [MICROSWITCH]
U23  NO  [MICROSWITCH]
U24  NO  [MICROSWITCH]
U25  NO  [MICROSWITCH]
U26  NO  [MICROSWITCH]
U27  NO  [MICROSWITCH]
U28  NO  [EM_18]
U29  3 PIN MALE JAMPER  [3PIN FEMALE HEADER]
U30  3PIN TERMINALBOCK  [5A_3PIN-TERMINALBLOCK]
U31  LED  [LED5]
U32  LED  [LED5]
U33  NO  [RELAY-TH_SRD-XXVDC-XL-C]
U34  2-PIN-MALE HEADER  [2PIN-MALE HEADER]
U35  6-pin male-male header  [5-PIN MALE-MALE HEADER]
U36  1k potentiometer  [POTENTIOMETER BLUE]
U37  ARDUINO UNO GD32  [UNO_R3;WO ARDUINO UNO]
sheet LCD Display
LCD1  LCD 16x2  [CLASE10LCD16X2]
U16  6-pin male-male header  [5-PIN MALE-MALE HEADER]
U17  1k potentiometer  [POTENTIOMETER BLUE]
U18  2-PIN-MALE HEADER  [2PIN-MALE HEADER]
sheet Relay Module
D1  1N4007  [DO-41_BD2.4-L4.7-P8.70-D0.9-RD]
Q2  BC548B  [TO-92-3_L4.9-W3.7-P1.27-L]
R1  1000Ω  [330Ω RESISTANCE]
R2  1000Ω  [330Ω RESISTANCE]
R3  1000Ω  [330Ω RESISTANCE]
U11  -  [RELAY-TH_SRD-XXVDC-XL-C]
U12  LED  [LED5]
U13  LED  [LED5]
U14  3PIN TERMINALBOCK  [5A_3PIN-TERMINALBLOCK]
U15  3 PIN MALE JAMPER  [3PIN FEMALE HEADER]

## Library data of the parts
CN1-CN3 = PINHEADER-6PIN6: Contributor: tiennguyenanh1
U1-U9 U19-U27 U38-U46 = ESO_SPST_Momentary: Contributor: LuckyStiff63; sourceId: F4cICwqI0
1R 2.1K 2.2K 2.3K 2R 470R = 1/4W-2.2KΩ±1%: Manufacturer: Huaxing Mechanical-Elec.; Supplier: LCSC; Supplier Part: C714002; Contributor: jellybeanstaffy; Convert to PCB: Yes; Add into BOM: Yes
BUZZER1-BUZZER3 = BUZZER: Contributor: lcsc; Supplier: LCSC; Supplier Part: C9900014030; Manufacturer: null; Manufacturer Part: buzzer; JLCPCB Part Class: Extended Part; link: https://lcsc.com/eda_search?q=C9900014030&%26type=1&ref=editor
C1 C4 C5 = 100UF/16V: Supplier: LCSC; Supplier Part: C9900021331; Manufacturer: null; Manufacturer Part: 100uF/16V; JLCPCB Part Class: Extended Part; Contributor: lcsc
C2 C3 C6 = 104nf: Supplier: LCSC; Manufacturer: ReliaPro; Manufacturer Part: Suppression Capacitor222M/250V; Supplier Part: C46751; Contributor: sunbin
LED LED1 LED2 U12 U13 U31 U32 U56 U57 = -LED
P1-P3 = HEADER PAD 3 PIN: Supplier: LCSC; Manufacturer: BOOMELE; Manufacturer Part: Female headerHDR1X8-2.54; Supplier Part: C27438; JLCPCB Part Class: Extended Part; Contributor: vincentboisselier
Q1 Q3 Q5 = BC557: Contributor: LCSC; Supplier Part: C180418; Supplier: LCSC; Manufacturer: CJ(江苏长电/长晶); JLCPCB Part Class: Extended Part; link: https://lcsc.com/eda_search?q=C180418&%26type=1&ref=editor
U37 U47 U51 U52 U54 = ARDUINO UNO GD32: Contributor: obaida.bohsas.shark; sourceId: frlCUcuMG
U10 U28 U53 = EM-18: Contributor: muhammedimdaad16
LCD1-LCD3 = LCD 16x2: Contributor: yutthanasing
U17 U36 U48 = Pot_blue: Supplier Part: C61836; Contributor: Dennis van der Velde; Convert to PCB: Yes; Add into BOM: Yes
U16 U35 U49 = 6-pin male-male header: Manufacturer: TE Connectivity; Manufacturer Part: 87224-5; Supplier Part: A26549-ND; link: https://www.digikey.com/en/products/detail/te-connectivity-amp-connectors/87224-5/295324?utm_adgroup=Essen%20Deinki&utm_source=google&utm_medium=cpc&utm_campaign=Shopping_DK%2BSupplier_Other&utm_term=&utm_content=Essen%20Deinki&gclid=EAIaIQobChMIl76j1KPQ9wIVirfICh1BfwQCEAQYASABEgL9fPD_BwE; Contributor: Soumarya
U18 U34 U50 = 2-PIN-MALE HEADER: Manufacturer: TE Connectivity; Manufacturer Part: 87224-5; Supplier Part: A26549-ND; link: https://www.digikey.com/en/products/detail/te-connectivity-amp-connectors/87224-5/295324?utm_adgroup=Essen%20Deinki&utm_source=google&utm_medium=cpc&utm_campaign=Shopping_DK%2BSupplier_Other&utm_term=&utm_content=Essen%20Deinki&gclid=EAIaIQobChMIl76j1KPQ9wIVirfICh1BfwQCEAQYASABEgL9fPD_BwE; Contributor: Soumarya
D1-D3 = 1N4007: Supplier: LCSC; Manufacturer: ST(先科); Supplier Part: C106903; JLCPCB Part Class: Extended Part; link: https://lcsc.com/eda_search?q=C106903&%26type=1&ref=editor
Q2 Q4 Q6 = BC548B: Supplier: LCSC; Manufacturer: CJ(江苏长电/长晶); Manufacturer Part: BC548; Supplier Part: C36611; JLCPCB Part Class: Extended Part; link: https://lcsc.com/eda_search?q=C36611&%26type=1&ref=editor
R1-R9 = 330Ω RESISTANCE: Supplier Part: C410657; Supplier: LCSC; Contributor: pritams07
U11 U33 U55 = SRD-05VDC-SL-C: Supplier: LCSC; Manufacturer: 松乐; Supplier Part: C35449; JLCPCB Part Class: Extended Part; Contributor: danishjr.hd
U15 U29 U58 = 3 PIN MALE JAMPER: Manufacturer Part: 1x3 pin header; Contributor: SHUBHASHISH; Supplier Part: NA; Manufacturer: NA; link: NA
U14 U30 U59 = 3PIN TERMINALBOCK: Contributor: abdullahsesli
+ - = TERMINAL-BLOCK-3.5MM-2-PIN-LONG-PAD: Contributor: Sujay Das; subpart_no: 1

## Nets
GND: BUZZER1.1(-) BUZZER2.1(-) BUZZER3.1(-) C1.2 C2.1 C3.1 C4.2 C5.2 C6.1 LCD2.1(Vss) LCD2.5(RW) LCD2.16(K) LCD3.1(Vss) LCD3.5(RW) LCD3.16(K) LED.CATHODE LED1.CATHODE LED2.CATHODE P1.2 P2.2 P3.2 Q2.3(E) Q4.3(E) Q6.3(E) U10.3(GND) U13.CATHODE U15.2 U28.3(GND) U29.2 U31.CATHODE U34.GND(2) U36.1 U37.26(GND1) U48.1 U50.GND(2) U51.26(GND1) U52.26(GND1) U53.3(GND) U54.26(GND1) U57.CATHODE U58.2
VCC: C1.1 C2.2 C3.2 C4.1 C5.1 C6.2 D1.1(K) D2.1(K) D3.1(K) LCD2.2(Vdd) LCD2.15(A) LCD3.2(Vdd) LCD3.15(A) P1.1 P2.1 P3.1 Q1.3(E) Q3.3(E) Q5.3(E) R1.2 R2.2 R5.2 R6.2 R7.2 R8.2 U10.1(VCC) U10.7(SEL) U11.2(IN) U15.1 U28.1(VCC) U28.7(SEL) U29.1 U33.2(IN) U34.VCC(1) U36.3(2) U37.28(5V) U48.3(2) U50.VCC(1) U51.28(5V) U52.28(5V) U53.1(VCC) U53.7(SEL) U54.28(5V) U55.2(IN) U58.1
C1: CN2.4(C1) CN3.4(C1) U19.1 U19.2 U22.1 U22.2 U27.1 U27.2 U37.9(D8) U38.1 U38.2 U43.1 U43.2 U46.1 U46.2 U47.9(D8)
C2: CN2.5(C2) CN3.5(C2) U20.1 U20.2 U23.1 U23.2 U26.1 U26.2 U37.10(D9) U39.1 U39.2 U42.1 U42.2 U45.1 U45.2 U47.10(D9)
C3: CN2.6(C3) CN3.6(C3) U21.1 U21.2 U24.1 U24.2 U25.1 U25.2 U37.11(D10) U40.1 U40.2 U41.1 U41.2 U44.1 U44.2 U47.11(D10)
COM: U11.3(COM) U14.2 U30.2 U33.3(COM) U37.25(VIN) U54.25(VIN) U55.3(COM) U59.2
D4: LCD2.11(DB4) LCD3.11(DB4) U35.D4(4) U37.21(A3) U49.D4(4) U51.21(A3)
D5: LCD2.12(DB5) LCD3.12(DB5) U35.D5(3) U37.22(A2) U49.D5(3) U51.22(A2)
D6: LCD2.13(DB6) LCD3.13(DB6) U35.D6(2) U37.23(A1) U49.D6(2) U51.23(A1)
D7: LCD2.14(DB7) LCD3.14(DB7) U35.D7(1) U37.24(A0) U49.D7(1) U51.24(A0)
E: LCD2.6(E) LCD3.6(E) U35.E(5) U37.20(A4) U49.E(5) U51.20(A4)
IN: R3.2 R4.2 R9.2 U15.3 U29.3 U37.3(D2) U54.3(D2) U58.3
NC: U11.4(NC) U14.1 U30.1 U33.4(NC) U55.4(NC) U59.1
NO: U14.3 U30.3 U59.3
OUT: P1.3 P2.3 P3.3 U10.8(TX) U28.8(TX) U37.1(D0) U52.1(D0) U53.8(TX)
R1: CN2.1(R1) CN3.1(R1) U25.3 U25.4 U26.3 U26.4 U27.3 U27.4 U37.6(D5) U38.3 U38.4 U39.3 U39.4 U40.3 U40.4 U47.6(D5)
R2: CN2.2(R2) CN3.2(R2) U22.3 U22.4 U23.3 U23.4 U24.3 U24.4 U37.7(D6) U41.3 U41.4 U42.3 U42.4 U43.3 U43.4 U47.7(D6)
R3: CN2.3(R3) CN3.3(R3) U19.3 U19.4 U20.3 U20.4 U21.3 U21.4 U37.8(D7) U44.3 U44.4 U45.3 U45.4 U46.3 U46.4 U47.8(D7)
RS: LCD2.4(RS) LCD3.4(RS) U35.RS(6) U37.19(A5) U49.RS(6) U51.19(A5)
Net-(1R-1): 1R.1 BUZZER2.2(+) Q3.1(C)
Net-(1R-2): 1R.2 LED1.ANODE
Net-(2.1K-1): 2.1K.1 U28.4(LED)
Net-(2.1K-2): 2.1K.2 Q3.2(B)
Net-(2.2K-1): 2.2K.1 U10.4(LED)
Net-(2.2K-2): 2.2K.2 Q1.2(B)
Net-(2.3K-1): 2.3K.1 U53.4(LED)
Net-(2.3K-2): 2.3K.2 Q5.2(B)
Net-(2R-1): 2R.1 BUZZER3.2(+) Q5.1(C)
Net-(2R-2): 2R.2 LED2.ANODE
Net-(470R-1): 470R.1 BUZZER1.2(+) Q1.1(C)
Net-(470R-2): 470R.2 LED.ANODE
Net-(CN1-1): CN1.1(R1) U1.3 U1.4 U2.3 U2.4 U3.3 U3.4
Net-(CN1-2): CN1.2(R2) U4.3 U4.4 U5.3 U5.4 U6.3 U6.4
Net-(CN1-3): CN1.3(R3) U7.3 U7.4 U8.3 U8.4 U9.3 U9.4
Net-(CN1-4): CN1.4(C1) U1.1 U1.2 U6.1 U6.2 U9.1 U9.2
Net-(CN1-5): CN1.5(C2) U2.1 U2.2 U5.1 U5.2 U8.1 U8.2
Net-(CN1-6): CN1.6(C3) U3.1 U3.2 U4.1 U4.2 U7.1 U7.2
Net-(D1-2): D1.2(A) Q2.1(C) U11.1(OT) U12.CATHODE
Net-(D2-2): D2.2(A) Q4.1(C) U32.CATHODE U33.1(OT)
Net-(D3-2): D3.2(A) Q6.1(C) U55.1(OT) U56.CATHODE
Net-(LCD1-1): LCD1.1(Vss) LCD1.5(RW) LCD1.16(K) U17.1 U18.2
Net-(LCD1-2): LCD1.2(Vdd) LCD1.15(A) U17.3(2) U18.1
Net-(LCD1-3): LCD1.3(V0) U17.2(3)
Net-(LCD1-4): LCD1.4(RS) U16.6
Net-(LCD1-6): LCD1.6(E) U16.5
Net-(LCD1-11): LCD1.11(DB4) U16.4
Net-(LCD1-12): LCD1.12(DB5) U16.3
Net-(LCD1-13): LCD1.13(DB6) U16.2
Net-(LCD1-14): LCD1.14(DB7) U16.1
Net-(LCD2-3): LCD2.3(V0) U36.2(3)
Net-(LCD3-3): LCD3.3(V0) U48.2(3)
Net-(Q2-2): Q2.2(B) R3.1
Net-(Q4-2): Q4.2(B) R4.1
Net-(Q6-2): Q6.2(B) R9.1
Net-(R1-1): R1.1 U12.ANODE
Net-(R2-1): R2.1 U13.ANODE
Net-(R5-1): R5.1 U31.ANODE
Net-(R6-1): R6.1 U32.ANODE
Net-(R7-1): R7.1 U56.ANODE
Net-(R8-1): R8.1 U57.ANODE

Not connected (* = marked no-connect by the designer): + 2(K); - 2(K); LCD1 7(DB0) 8(DB1) 9(DB2) 10(DB3); LCD2 7(DB0) 8(DB1) 9(DB2) 10(DB3); LCD3 7(DB0) 8(DB1) 9(DB2) 10(DB3); U10 2(NC) 5(NC) 6(NC) 9(D1) 10(D2); U11 5(NO); U28 2(NC) 5(NC) 6(NC) 9(D1) 10(D2); U33 5(NO); U37 2(D1) 4(D3) 5(D4) 12(D11) 13(D12) 14(D13) 15(GND) 16(AREF) 17(SDA) 18(SCL) 27(GND2) 29(3V) 30(RESET) 31(IOREF) 32(USART1); U47 1(D0) 2(D1) 3(D2) 4(D3) 5(D4) 12(D11) 13(D12) 14(D13) 15(GND) 16(AREF) 17(SDA) 18(SCL) 19(A5) 20(A4) 21(A3) 22(A2) 23(A1) 24(A0) 25(VIN) 26(GND1) 27(GND2) 28(5V) 29(3V) 30(RESET) 31(IOREF) 32(USART1); U51 1(D0) 2(D1) 3(D2) 4(D3) 5(D4) 6(D5) 7(D6) 8(D7) 9(D8) 10(D9) 11(D10) 12(D11) 13(D12) 14(D13) 15(GND) 16(AREF) 17(SDA) 18(SCL) 25(VIN) 27(GND2) 29(3V) 30(RESET) 31(IOREF) 32(USART1); U52 2(D1) 3(D2) 4(D3) 5(D4) 6(D5) 7(D6) 8(D7) 9(D8) 10(D9) 11(D10) 12(D11) 13(D12) 14(D13) 15(GND) 16(AREF) 17(SDA) 18(SCL) 19(A5) 20(A4) 21(A3) 22(A2) 23(A1) 24(A0) 25(VIN) 27(GND2) 29(3V) 30(RESET) 31(IOREF) 32(USART1); U53 2(NC) 5(NC) 6(NC) 9(D1) 10(D2); U54 1(D0) 2(D1) 4(D3) 5(D4) 6(D5) 7(D6) 8(D7) 9(D8) 10(D9) 11(D10) 12(D11) 13(D12) 14(D13) 15(GND) 16(AREF) 17(SDA) 18(SCL) 19(A5) 20(A4) 21(A3) 22(A2) 23(A1) 24(A0) 27(GND2) 29(3V) 30(RESET) 31(IOREF) 32(USART1); U55 5(NO)

## Notes on the sheets
sheet 1
- PHYSICAL COMPONENTS
sheet 2
- PHYSICAL COMPONENTS
sheet 3
- PHYSICAL COMPONENTS
- 5V RELAY
sheet 4
- PHYSICAL COMPONENTS
sheet 5
- Solenoid Door Lock
- 5V RELAY
sheet 9
- 5V RELAY
